# Altium project US29080671(A).PrjPCB (part 7 of 10)

## Sheet Z7_MGTX.SchDoc
size A3
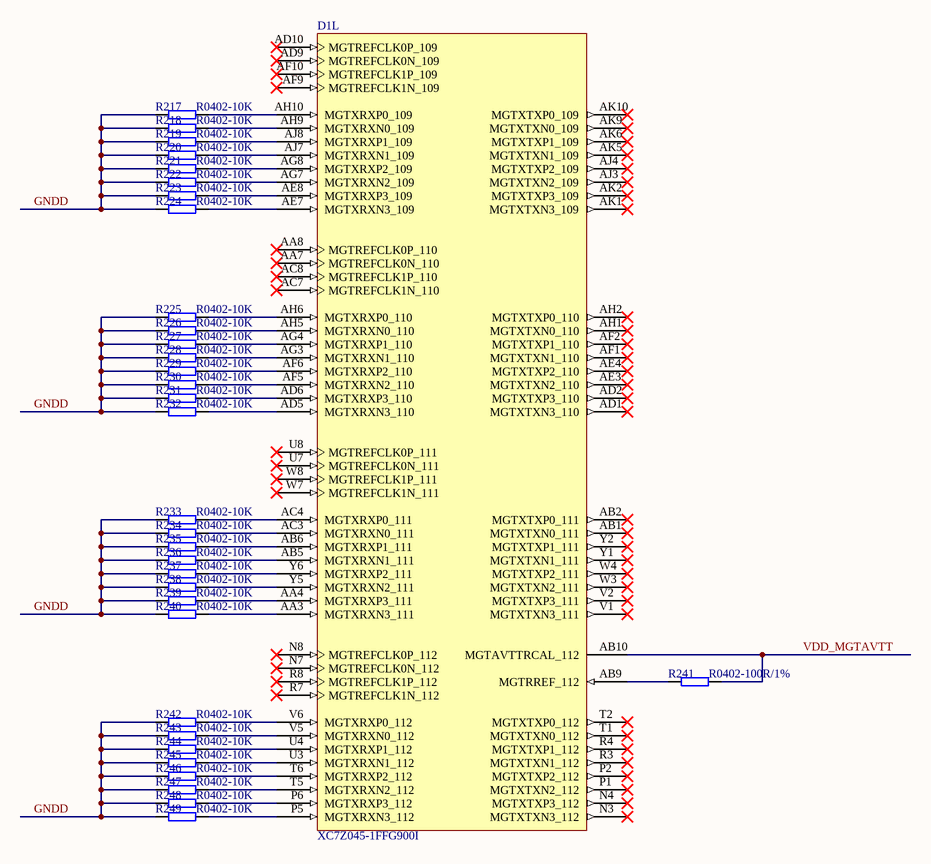
[diagram p32: Z7_MGTX.SchDoc]

### Parts
D1  XC7Z045-1FFG900I  [FFG900]  (part L of 16)
R217  R0402-10K  [R0402]
R218  R0402-10K  [R0402]
R219  R0402-10K  [R0402]
R220  R0402-10K  [R0402]
R221  R0402-10K  [R0402]
R222  R0402-10K  [R0402]
R223  R0402-10K  [R0402]
R224  R0402-10K  [R0402]
R225  R0402-10K  [R0402]
R226  R0402-10K  [R0402]
R227  R0402-10K  [R0402]
R228  R0402-10K  [R0402]
R229  R0402-10K  [R0402]
R230  R0402-10K  [R0402]
R231  R0402-10K  [R0402]
R232  R0402-10K  [R0402]
R233  R0402-10K  [R0402]
R234  R0402-10K  [R0402]
R235  R0402-10K  [R0402]
R236  R0402-10K  [R0402]
R237  R0402-10K  [R0402]
R238  R0402-10K  [R0402]
R239  R0402-10K  [R0402]
R240  R0402-10K  [R0402]
R241  R0402-100R/1%  [R0402]
R242  R0402-10K  [R0402]
R243  R0402-10K  [R0402]
R244  R0402-10K  [R0402]
R245  R0402-10K  [R0402]
R246  R0402-10K  [R0402]
R247  R0402-10K  [R0402]
R248  R0402-10K  [R0402]
R249  R0402-10K  [R0402]

### Nets
GNDD: R217.2 R218.2 R219.2 R220.2 R221.2 R222.2 R223.2 R224.2 R225.2 R226.2 R227.2 R228.2 R229.2 R230.2 R231.2 R232.2 R233.2 R234.2 R235.2 R236.2 R237.2 R238.2 R239.2 R240.2 R242.2 R243.2 R244.2 R245.2 R246.2 R247.2 R248.2 R249.2
VDD_MGTAVTT: D1.AB10(MGTAVTTRCAL_112) R241.1  [project net VCC1V2]
NetD1_AA3: D1.AA3(MGTXRXN3_111) R240.1
NetD1_AA4: D1.AA4(MGTXRXP3_111) R239.1
NetD1_AB5: D1.AB5(MGTXRXN1_111) R236.1
NetD1_AB6: D1.AB6(MGTXRXP1_111) R235.1
NetD1_AB9: D1.AB9(MGTRREF_112) R241.2
NetD1_AC3: D1.AC3(MGTXRXN0_111) R234.1
NetD1_AC4: D1.AC4(MGTXRXP0_111) R233.1
NetD1_AD5: D1.AD5(MGTXRXN3_110) R232.1
NetD1_AD6: D1.AD6(MGTXRXP3_110) R231.1
NetD1_AE7: D1.AE7(MGTXRXN3_109) R224.1
NetD1_AE8: D1.AE8(MGTXRXP3_109) R223.1
NetD1_AF5: D1.AF5(MGTXRXN2_110) R230.1
NetD1_AF6: D1.AF6(MGTXRXP2_110) R229.1
NetD1_AG3: D1.AG3(MGTXRXN1_110) R228.1
NetD1_AG4: D1.AG4(MGTXRXP1_110) R227.1
NetD1_AG7: D1.AG7(MGTXRXN2_109) R222.1
NetD1_AG8: D1.AG8(MGTXRXP2_109) R221.1
NetD1_AH5: D1.AH5(MGTXRXN0_110) R226.1
NetD1_AH6: D1.AH6(MGTXRXP0_110) R225.1
NetD1_AH9: D1.AH9(MGTXRXN0_109) R218.1
NetD1_AH10: D1.AH10(MGTXRXP0_109) R217.1
NetD1_AJ7: D1.AJ7(MGTXRXN1_109) R220.1
NetD1_AJ8: D1.AJ8(MGTXRXP1_109) R219.1
NetD1_P5: D1.P5(MGTXRXN3_112) R249.1
NetD1_P6: D1.P6(MGTXRXP3_112) R248.1
NetD1_T5: D1.T5(MGTXRXN2_112) R247.1
NetD1_T6: D1.T6(MGTXRXP2_112) R246.1
NetD1_U3: D1.U3(MGTXRXN1_112) R245.1
NetD1_U4: D1.U4(MGTXRXP1_112) R244.1
NetD1_V5: D1.V5(MGTXRXN0_112) R243.1
NetD1_V6: D1.V6(MGTXRXP0_112) R242.1
NetD1_Y5: D1.Y5(MGTXRXN2_111) R238.1
NetD1_Y6: D1.Y6(MGTXRXP2_111) R237.1

Not connected (* = marked no-connect by the designer): D1 AA7(MGTREFCLK0N_110)* AA8(MGTREFCLK0P_110)* AB1(MGTXTXN0_111)* AB2(MGTXTXP0_111)* AC7(MGTREFCLK1N_110)* AC8(MGTREFCLK1P_110)* AD1(MGTXTXN3_110)* AD2(MGTXTXP3_110)* AD9(MGTREFCLK0N_109)* AD10(MGTREFCLK0P_109)* AE3(MGTXTXN2_110)* AE4(MGTXTXP2_110)* AF1(MGTXTXN1_110)* AF2(MGTXTXP1_110)* AF9(MGTREFCLK1N_109)* AF10(MGTREFCLK1P_109)* AH1(MGTXTXN0_110)* AH2(MGTXTXP0_110)* AJ3(MGTXTXN2_109)* AJ4(MGTXTXP2_109)* AK1(MGTXTXN3_109)* AK2(MGTXTXP3_109)* AK5(MGTXTXN1_109)* AK6(MGTXTXP1_109)* AK9(MGTXTXN0_109)* AK10(MGTXTXP0_109)* N3(MGTXTXN3_112)* N4(MGTXTXP3_112)* N7(MGTREFCLK0N_112)* N8(MGTREFCLK0P_112)* P1(MGTXTXN2_112)* P2(MGTXTXP2_112)* R3(MGTXTXN1_112)* R4(MGTXTXP1_112)* R7(MGTREFCLK1N_112)* R8(MGTREFCLK1P_112)* T1(MGTXTXN0_112)* T2(MGTXTXP0_112)* U7(MGTREFCLK0N_111)* U8(MGTREFCLK0P_111)* V1(MGTXTXN3_111)* V2(MGTXTXP3_111)* W3(MGTXTXN2_111)* W4(MGTXTXP2_111)* W7(MGTREFCLK1N_111)* W8(MGTREFCLK1P_111)* Y1(MGTXTXN1_111)* Y2(MGTXTXP1_111)*

### Library data of the parts
D1 = XC7Z045-1FFG900I: 667 MHz Zynq?7000 AP SoC, 130 PS I/O, 378 FPGA I/O, 900-Ball BGA, Speed Grade 1, Industrial Grade, Pb-Free; Manufacturer: Xilinx; Extensible Block RAM (# 36Kb Blocks): 2180 KB (545); Flip Flops: 437200; LUTs: 218600; Speed Grade: -1; DatasheetVersion: v1.2; PackageVersion: Rev 1.1; PackageReference: FFG900; PackageDescription: Flip-Chip BGA, Body 31 x 31 mm, 1.0 mm Pitch; Generic Part Number: XC7Z045; RoHS: Pb-Free; Mounting Technology: Surface Mount; Code_JEDEC: MS-034-AAN-1; PartNumber: XC7Z045-1FFG900I; ComponentLink1Description: Datasheet; ComponentLink1URL: http://www.xilinx.com/support/documentation/data_sheets/ds190-Zynq-7000-Overview.pdf; ComponentLink2Description: Package Specification; ComponentLink2URL: http://www.xilinx.com/support/documentation/user_guides/ug865-Zynq-7000-Pkg-Pinout.pdf; ComponentLink3Description: DC and AC Switching Characteristics; ComponentLink3URL: http://www.xilinx.com/support/documentation/data_sheets/ds191-XC7Z030-XC7Z045-data-sheet.pdf; ComponentLink4Description: Package File; ComponentLink4URL: http://www.xilinx.com/support/packagefiles/z7packages/xc7z045ffg900pkg.txt; ComponentLink5Description: Packaging and Pinout; ComponentLink5URL: http://www.xilinx.com/support/documentation/user_guides/ug865-Zynq-7000-Pkg-Pinout.pdf; ComponentLink6Description: PCB and Layout Guide; ComponentLink6URL: http://www.xilinx.com/support/documentation/user_guides/ug483_7Series_PCB.pdf
R217-R249 = R0402-10K: Manufacturer: SAMSUNG; Part_type: RES; Schematic_Part: RES; PCB_Footprint: R0402
  R217-R240 R242-R249: Part_number: R0402-10K; Value: R0402-10K
  R241: Part_number: R0402-100R/1%; Value: R0402-100R/1%

## Sheet Z7_FUNCTION1.SchDoc
size A3
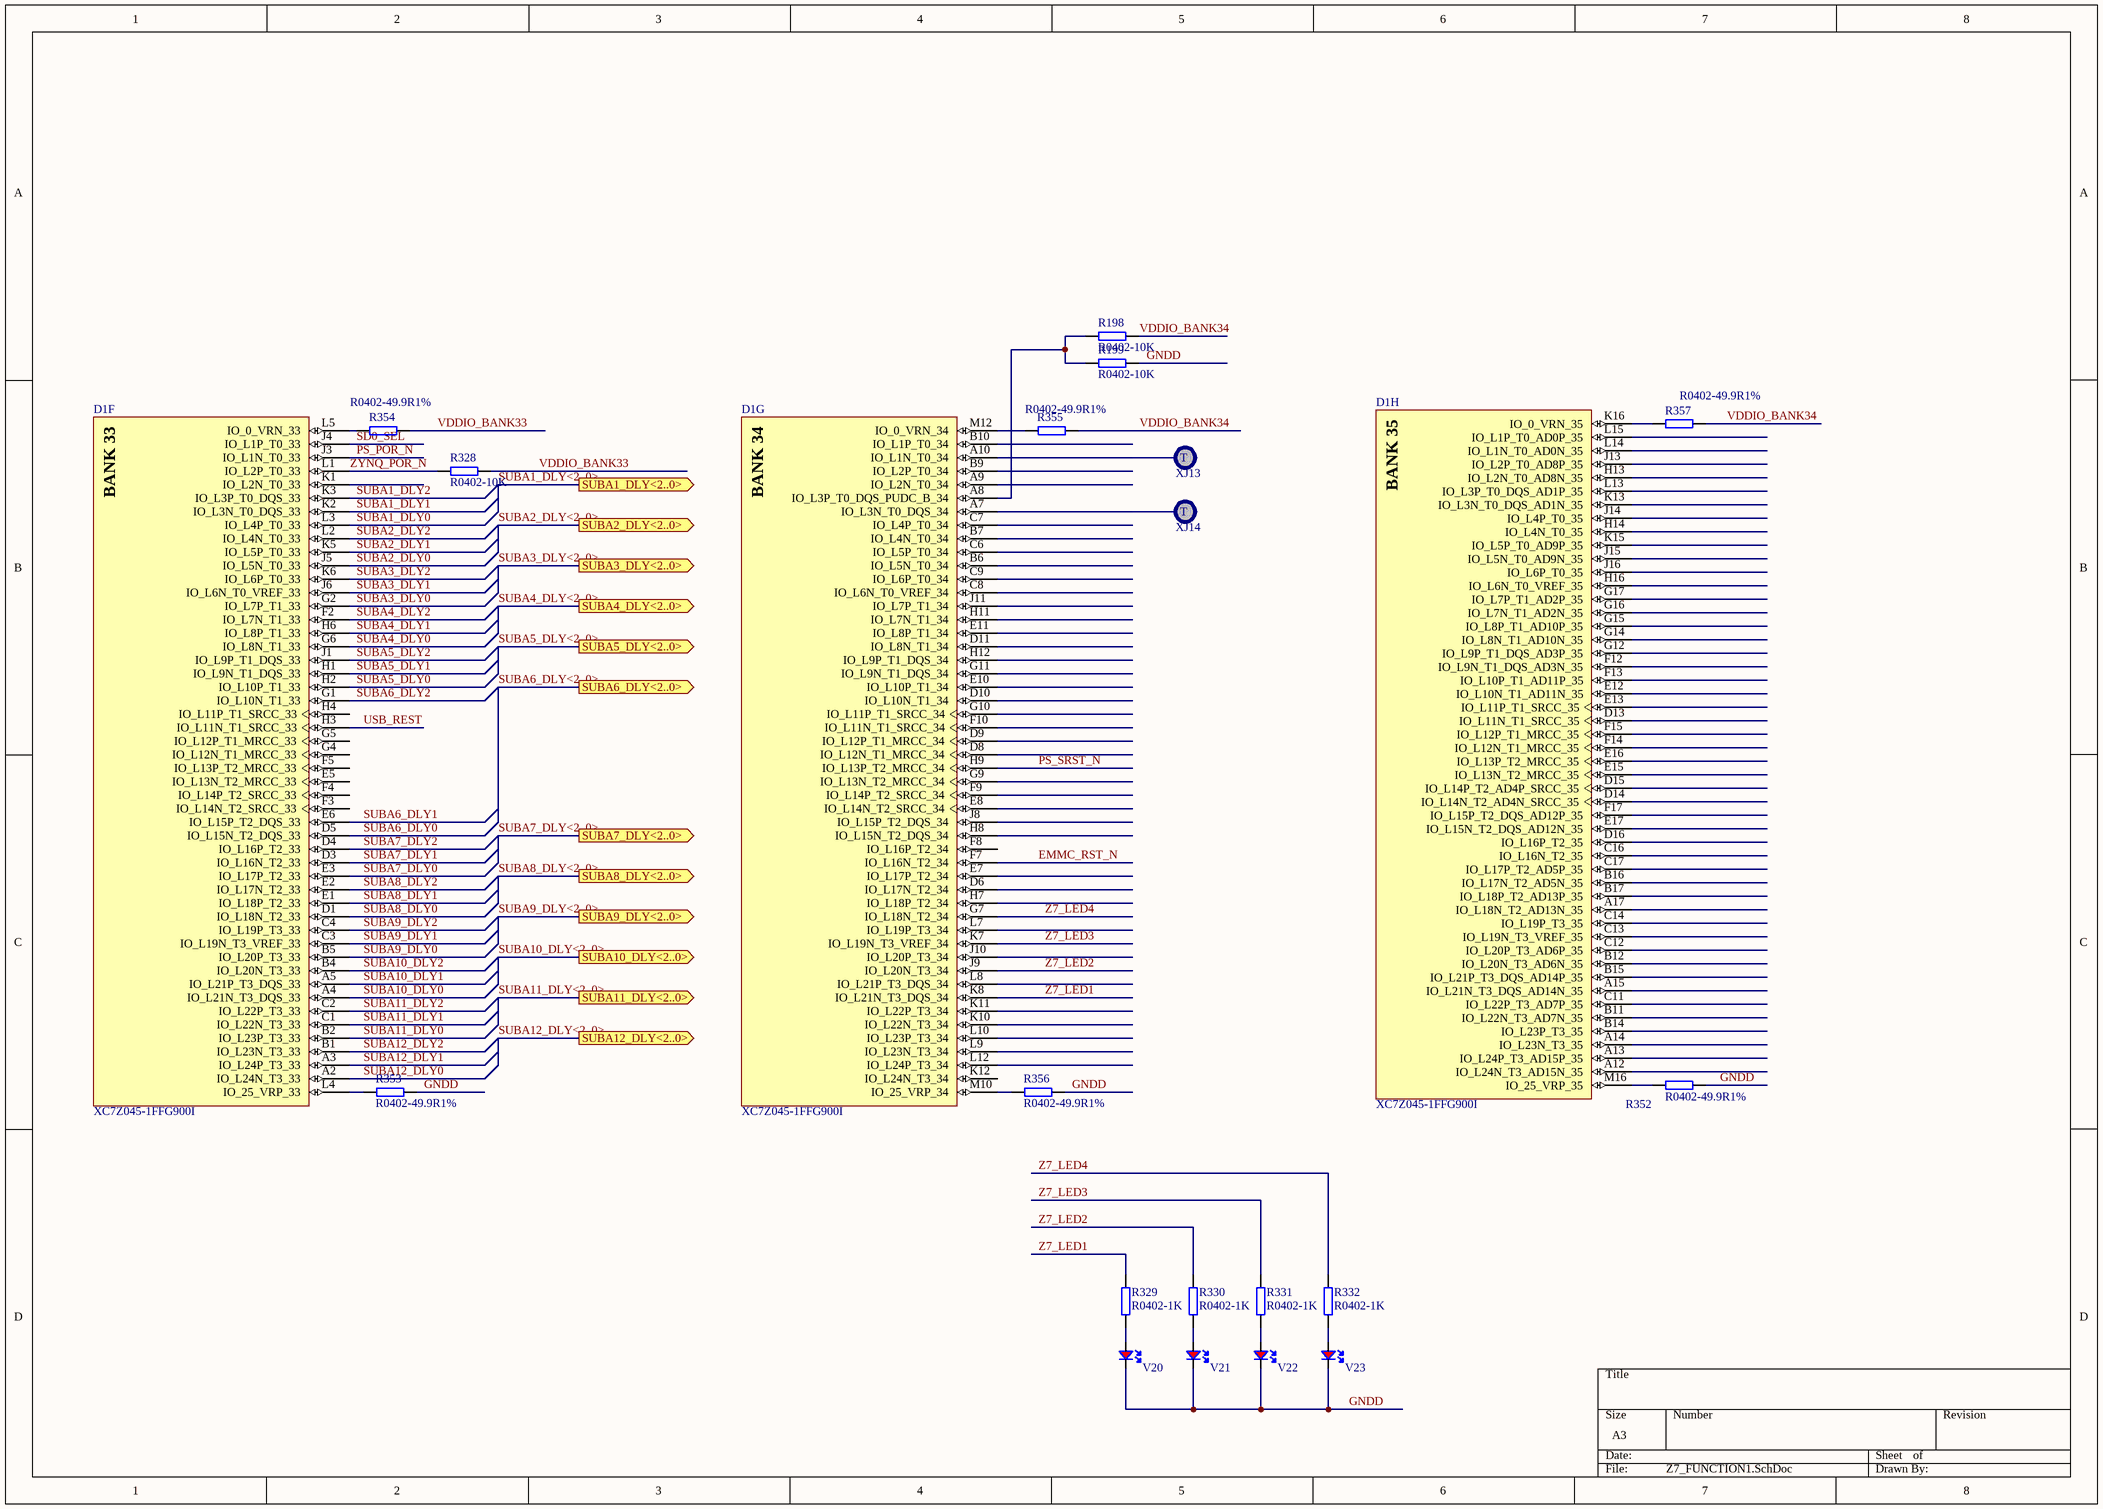
[diagram p33: Z7_FUNCTION1.SchDoc]

### Parts
D1  XC7Z045-1FFG900I  [FFG900]  (parts F,G,H of 16)
R198  R0402-10K  [R0402]
R199  R0402-10K  [R0402]
R328  R0402-10K  [R0402]
R329  R0402-1K  [R0402]
R330  R0402-1K  [R0402]
R331  R0402-1K  [R0402]
R332  R0402-1K  [R0402]
R352  R0402-49.9R1%  [R0402]
R353  R0402-49.9R1%  [R0402]
R354  R0402-49.9R1%  [R0402]
R355  R0402-49.9R1%  [R0402]
R356  R0402-49.9R1%  [R0402]
R357  R0402-49.9R1%  [R0402]
V20  LED-R0603  [LED-R0603]  (value not drawn)
V21  LED-R0603  [LED-R0603]  (value not drawn)
V22  LED-R0603  [LED-R0603]  (value not drawn)
V23  LED-R0603  [LED-R0603]  (value not drawn)
XJ13  TESTPOINT  [TEST-pin]  (value not drawn)
XJ14  TESTPOINT  [TEST-pin]  (value not drawn)

### Ports
SUBA1_DLY<2..0> (out), SUBA2_DLY<2..0> (out), SUBA3_DLY<2..0> (out), SUBA4_DLY<2..0> (out), SUBA5_DLY<2..0> (out), SUBA6_DLY<2..0> (out), SUBA7_DLY<2..0> (out), SUBA8_DLY<2..0> (out), SUBA9_DLY<2..0> (out), SUBA10_DLY<2..0> (out), SUBA11_DLY<2..0> (out), SUBA12_DLY<2..0> (out)

### Nets
GNDD: R199.2 R352.2 R353.2 R356.2 V20.2(K) V21.2(K) V22.2(K) V23.2(K)
VDDIO_BANK33: R198.2 R328.1 R354.2 R355.2 R357.2  [also labelled VDDIO_BANK34]  [project net VCC1V8]
EMMC_RST_N: D1.F7(IO_L16N_T2_34)
PS_POR_N: D1.J3(IO_L1N_T0_33)
PS_SRST_N: D1.H9(IO_L13P_T2_MRCC_34)
SD0_SEL: D1.J4(IO_L1P_T0_33)
SUBA1_DLY0: D1.L3(IO_L4P_T0_33)
SUBA1_DLY1: D1.K2(IO_L3N_T0_DQS_33)
SUBA1_DLY2: D1.K3(IO_L3P_T0_DQS_33)
SUBA2_DLY0: D1.J5(IO_L5N_T0_33)
SUBA2_DLY1: D1.K5(IO_L5P_T0_33)
SUBA2_DLY2: D1.L2(IO_L4N_T0_33)
SUBA3_DLY0: D1.G2(IO_L7P_T1_33)
SUBA3_DLY1: D1.J6(IO_L6N_T0_VREF_33)
SUBA3_DLY2: D1.K6(IO_L6P_T0_33)
SUBA4_DLY0: D1.G6(IO_L8N_T1_33)
SUBA4_DLY1: D1.H6(IO_L8P_T1_33)
SUBA4_DLY2: D1.F2(IO_L7N_T1_33)
SUBA5_DLY0: D1.H2(IO_L10P_T1_33)
SUBA5_DLY1: D1.H1(IO_L9N_T1_DQS_33)
SUBA5_DLY2: D1.J1(IO_L9P_T1_DQS_33)
SUBA6_DLY0: D1.D5(IO_L15N_T2_DQS_33)
SUBA6_DLY1: D1.E6(IO_L15P_T2_DQS_33)
SUBA6_DLY2: D1.G1(IO_L10N_T1_33)
SUBA7_DLY0: D1.E3(IO_L17P_T2_33)
SUBA7_DLY1: D1.D3(IO_L16N_T2_33)
SUBA7_DLY2: D1.D4(IO_L16P_T2_33)
SUBA8_DLY0: D1.D1(IO_L18N_T2_33)
SUBA8_DLY1: D1.E1(IO_L18P_T2_33)
SUBA8_DLY2: D1.E2(IO_L17N_T2_33)
SUBA9_DLY0: D1.B5(IO_L20P_T3_33)
SUBA9_DLY1: D1.C3(IO_L19N_T3_VREF_33)
SUBA9_DLY2: D1.C4(IO_L19P_T3_33)
SUBA10_DLY0: D1.A4(IO_L21N_T3_DQS_33)
SUBA10_DLY1: D1.A5(IO_L21P_T3_DQS_33)
SUBA10_DLY2: D1.B4(IO_L20N_T3_33)
SUBA11_DLY0: D1.B2(IO_L23P_T3_33)
SUBA11_DLY1: D1.C1(IO_L22N_T3_33)
SUBA11_DLY2: D1.C2(IO_L22P_T3_33)
SUBA12_DLY0: D1.A2(IO_L24N_T3_33)
SUBA12_DLY1: D1.A3(IO_L24P_T3_33)
SUBA12_DLY2: D1.B1(IO_L23N_T3_33)
USB_REST: D1.H3(IO_L11N_T1_SRCC_33)
Z7_LED1: D1.K8(IO_L21N_T3_DQS_34) R329.2
Z7_LED2: D1.J9(IO_L20N_T3_34) R330.2
Z7_LED3: D1.K7(IO_L19N_T3_VREF_34) R331.2
Z7_LED4: D1.G7(IO_L18N_T2_34) R332.2
ZYNQ_POR_N: D1.L1(IO_L2P_T0_33) R328.2
NetD1_A7: D1.A7(IO_L3N_T0_DQS_34) XJ14.1(T)
NetD1_A8: D1.A8(IO_L3P_T0_DQS_PUDC_B_34) R198.1 R199.1
NetD1_A10: D1.A10(IO_L1N_T0_34) XJ13.1(T)
NetD1_K16: D1.K16(IO_0_VRN_35) R357.1
NetD1_L4: D1.L4(IO_25_VRP_33) R353.1
NetD1_L5: D1.L5(IO_0_VRN_33) R354.1
NetD1_M10: D1.M10(IO_25_VRP_34) R356.1
NetD1_M12: D1.M12(IO_0_VRN_34) R355.1
NetD1_M16: D1.M16(IO_25_VRP_35) R352.1
NetR329_1: R329.1 V20.1(A)
NetR330_1: R330.1 V21.1(A)
NetR331_1: R331.1 V22.1(A)
NetR332_1: R332.1 V23.1(A)

Not connected (* = marked no-connect by the designer): D1 A9(IO_L2N_T0_34) A12(IO_L24N_T3_AD15N_35) A13(IO_L24P_T3_AD15P_35) A14(IO_L23N_T3_35) A15(IO_L21N_T3_DQS_AD14N_35) A17(IO_L18N_T2_AD13N_35) B6(IO_L5N_T0_34) B7(IO_L4N_T0_34) B9(IO_L2P_T0_34) B10(IO_L1P_T0_34) B11(IO_L22N_T3_AD7N_35) B12(IO_L20N_T3_AD6N_35) B14(IO_L23P_T3_35) B15(IO_L21P_T3_DQS_AD14P_35) B16(IO_L17N_T2_AD5N_35) B17(IO_L18P_T2_AD13P_35) C6(IO_L5P_T0_34) C7(IO_L4P_T0_34) C8(IO_L6N_T0_VREF_34) C9(IO_L6P_T0_34) C11(IO_L22P_T3_AD7P_35) C12(IO_L20P_T3_AD6P_35) C13(IO_L19N_T3_VREF_35) C14(IO_L19P_T3_35) C16(IO_L16N_T2_35) C17(IO_L17P_T2_AD5P_35) D6(IO_L17N_T2_34) D8(IO_L12N_T1_MRCC_34) D9(IO_L12P_T1_MRCC_34) D10(IO_L10N_T1_34) D11(IO_L8N_T1_34) D13(IO_L11N_T1_SRCC_35) D14(IO_L14N_T2_AD4N_SRCC_35) D15(IO_L14P_T2_AD4P_SRCC_35) D16(IO_L16P_T2_35) E5(IO_L13N_T2_MRCC_33) E7(IO_L17P_T2_34) E8(IO_L14N_T2_SRCC_34) E10(IO_L10P_T1_34) E11(IO_L8P_T1_34) E12(IO_L10N_T1_AD11N_35) E13(IO_L11P_T1_SRCC_35) E15(IO_L13N_T2_MRCC_35) E16(IO_L13P_T2_MRCC_35) E17(IO_L15N_T2_DQS_AD12N_35) F3(IO_L14N_T2_SRCC_33) F4(IO_L14P_T2_SRCC_33) F5(IO_L13P_T2_MRCC_33) F8(IO_L16P_T2_34) F9(IO_L14P_T2_SRCC_34) F10(IO_L11N_T1_SRCC_34) F12(IO_L9N_T1_DQS_AD3N_35) F13(IO_L10P_T1_AD11P_35) F14(IO_L12N_T1_MRCC_35) F15(IO_L12P_T1_MRCC_35) F17(IO_L15P_T2_DQS_AD12P_35) G4(IO_L12N_T1_MRCC_33) G5(IO_L12P_T1_MRCC_33) G9(IO_L13N_T2_MRCC_34) G10(IO_L11P_T1_SRCC_34) G11(IO_L9N_T1_DQS_34) G12(IO_L9P_T1_DQS_AD3P_35) G14(IO_L8N_T1_AD10N_35) G15(IO_L8P_T1_AD10P_35) G16(IO_L7N_T1_AD2N_35) G17(IO_L7P_T1_AD2P_35) H4(IO_L11P_T1_SRCC_33) H7(IO_L18P_T2_34) H8(IO_L15N_T2_DQS_34) H11(IO_L7N_T1_34) H12(IO_L9P_T1_DQS_34) H13(IO_L2N_T0_AD8N_35) H14(IO_L4N_T0_35) H16(IO_L6N_T0_VREF_35) J8(IO_L15P_T2_DQS_34) J10(IO_L20P_T3_34) J11(IO_L7P_T1_34) J13(IO_L2P_T0_AD8P_35) J14(IO_L4P_T0_35) J15(IO_L5N_T0_AD9N_35) J16(IO_L6P_T0_35) K1(IO_L2N_T0_33) K10(IO_L22N_T3_34) K11(IO_L22P_T3_34) K12(IO_L24N_T3_34) K13(IO_L3N_T0_DQS_AD1N_35) K15(IO_L5P_T0_AD9P_35) L7(IO_L19P_T3_34) L8(IO_L21P_T3_DQS_34) L9(IO_L23N_T3_34) L10(IO_L23P_T3_34) L12(IO_L24P_T3_34) L13(IO_L3P_T0_DQS_AD1P_35) L14(IO_L1N_T0_AD0N_35) L15(IO_L1P_T0_AD0P_35)

### Buses and harness runs
bus SUBA1_DLY<2..0> = port SUBA1_DLY<2..0>
bus SUBA2_DLY<2..0> = port SUBA2_DLY<2..0>
bus SUBA3_DLY<2..0> = port SUBA3_DLY<2..0>
bus SUBA4_DLY<2..0> = port SUBA4_DLY<2..0>
bus SUBA5_DLY<2..0> = port SUBA5_DLY<2..0>
bus SUBA6_DLY<2..0> = port SUBA6_DLY<2..0>
bus SUBA7_DLY<2..0> = port SUBA7_DLY<2..0>
bus SUBA8_DLY<2..0> = port SUBA8_DLY<2..0>
bus SUBA9_DLY<2..0> = port SUBA9_DLY<2..0>
bus SUBA10_DLY<2..0> = port SUBA10_DLY<2..0>
bus SUBA11_DLY<2..0> = port SUBA11_DLY<2..0>
bus SUBA12_DLY<2..0> = port SUBA12_DLY<2..0>

### Notes on the sheet
- (in symbol XC7Z045-1FFG900I, part F) BANK 33
- (in symbol XC7Z045-1FFG900I, part G) BANK 34
- (in symbol XC7Z045-1FFG900I, part H) BANK 35

### Library data of the parts
D1 = XC7Z045-1FFG900I: as D1 on sheet Z7_MGTX; DatasheetVersion: v1.2; PackageVersion: Rev 1.1; PackageReference: FFG900; PackageDescription: Flip-Chip BGA, Body 31 x 31 mm, 1.0 mm Pitch; Generic Part Number: XC7Z045; RoHS: Pb-Free; Mounting Technology: Surface Mount; Code_JEDEC: MS-034-AAN-1; PartNumber: XC7Z045-1FFG900I; ComponentLink1Description: Datasheet; ComponentLink1URL: http://www.xilinx.com/support/documentation/data_sheets/ds190-Zynq-7000-Overview.pdf; ComponentLink2Description: Package Specification; ComponentLink2URL: http://www.xilinx.com/support/documentation/user_guides/ug865-Zynq-7000-Pkg-Pinout.pdf; ComponentLink3Description: DC and AC Switching Characteristics; ComponentLink3URL: http://www.xilinx.com/support/documentation/data_sheets/ds191-XC7Z030-XC7Z045-data-sheet.pdf; ComponentLink4Description: Package File; ComponentLink4URL: http://www.xilinx.com/support/packagefiles/z7packages/xc7z045ffg900pkg.txt; ComponentLink5Description: Packaging and Pinout; ComponentLink5URL: http://www.xilinx.com/support/documentation/user_guides/ug865-Zynq-7000-Pkg-Pinout.pdf; ComponentLink6Description: PCB and Layout Guide; ComponentLink6URL: http://www.xilinx.com/support/documentation/user_guides/ug483_7Series_PCB.pdf
R198 R199 R328-R332 R352-R357 = R0402-10K: Manufacturer: SAMSUNG; Part_type: RES; Schematic_Part: RES; PCB_Footprint: R0402
  R198 R199 R328: Part_number: R0402-10K; Value: R0402-10K
  R329-R332: Part_number: R0402-1K; Value: R0402-1K
  R352-R357: Part_number: R0402-49.9R1%; Value: R0402-49.9R1%
V20-V23 = LED-R0603: 表贴发光二极管, 0603封装, 体积1.6x0.8mm, 红色, 高度0.8mm; Part_type: DIODES; Part_number: LED-R0603; Value: LED-R0603; Schematic_Part: LED-R; PCB_Footprint: LED-R0603
XJ13 XJ14 = TESTPOINT: 测试点; Part_type: Miscellaneous; Part_number: TESTPOINT; Value: TESTPOINT; Schematic_Part: TESTPOINT; PCB_Footprint: TEST-pin

## Sheet Z7_FUNCTION2.SchDoc
size A3
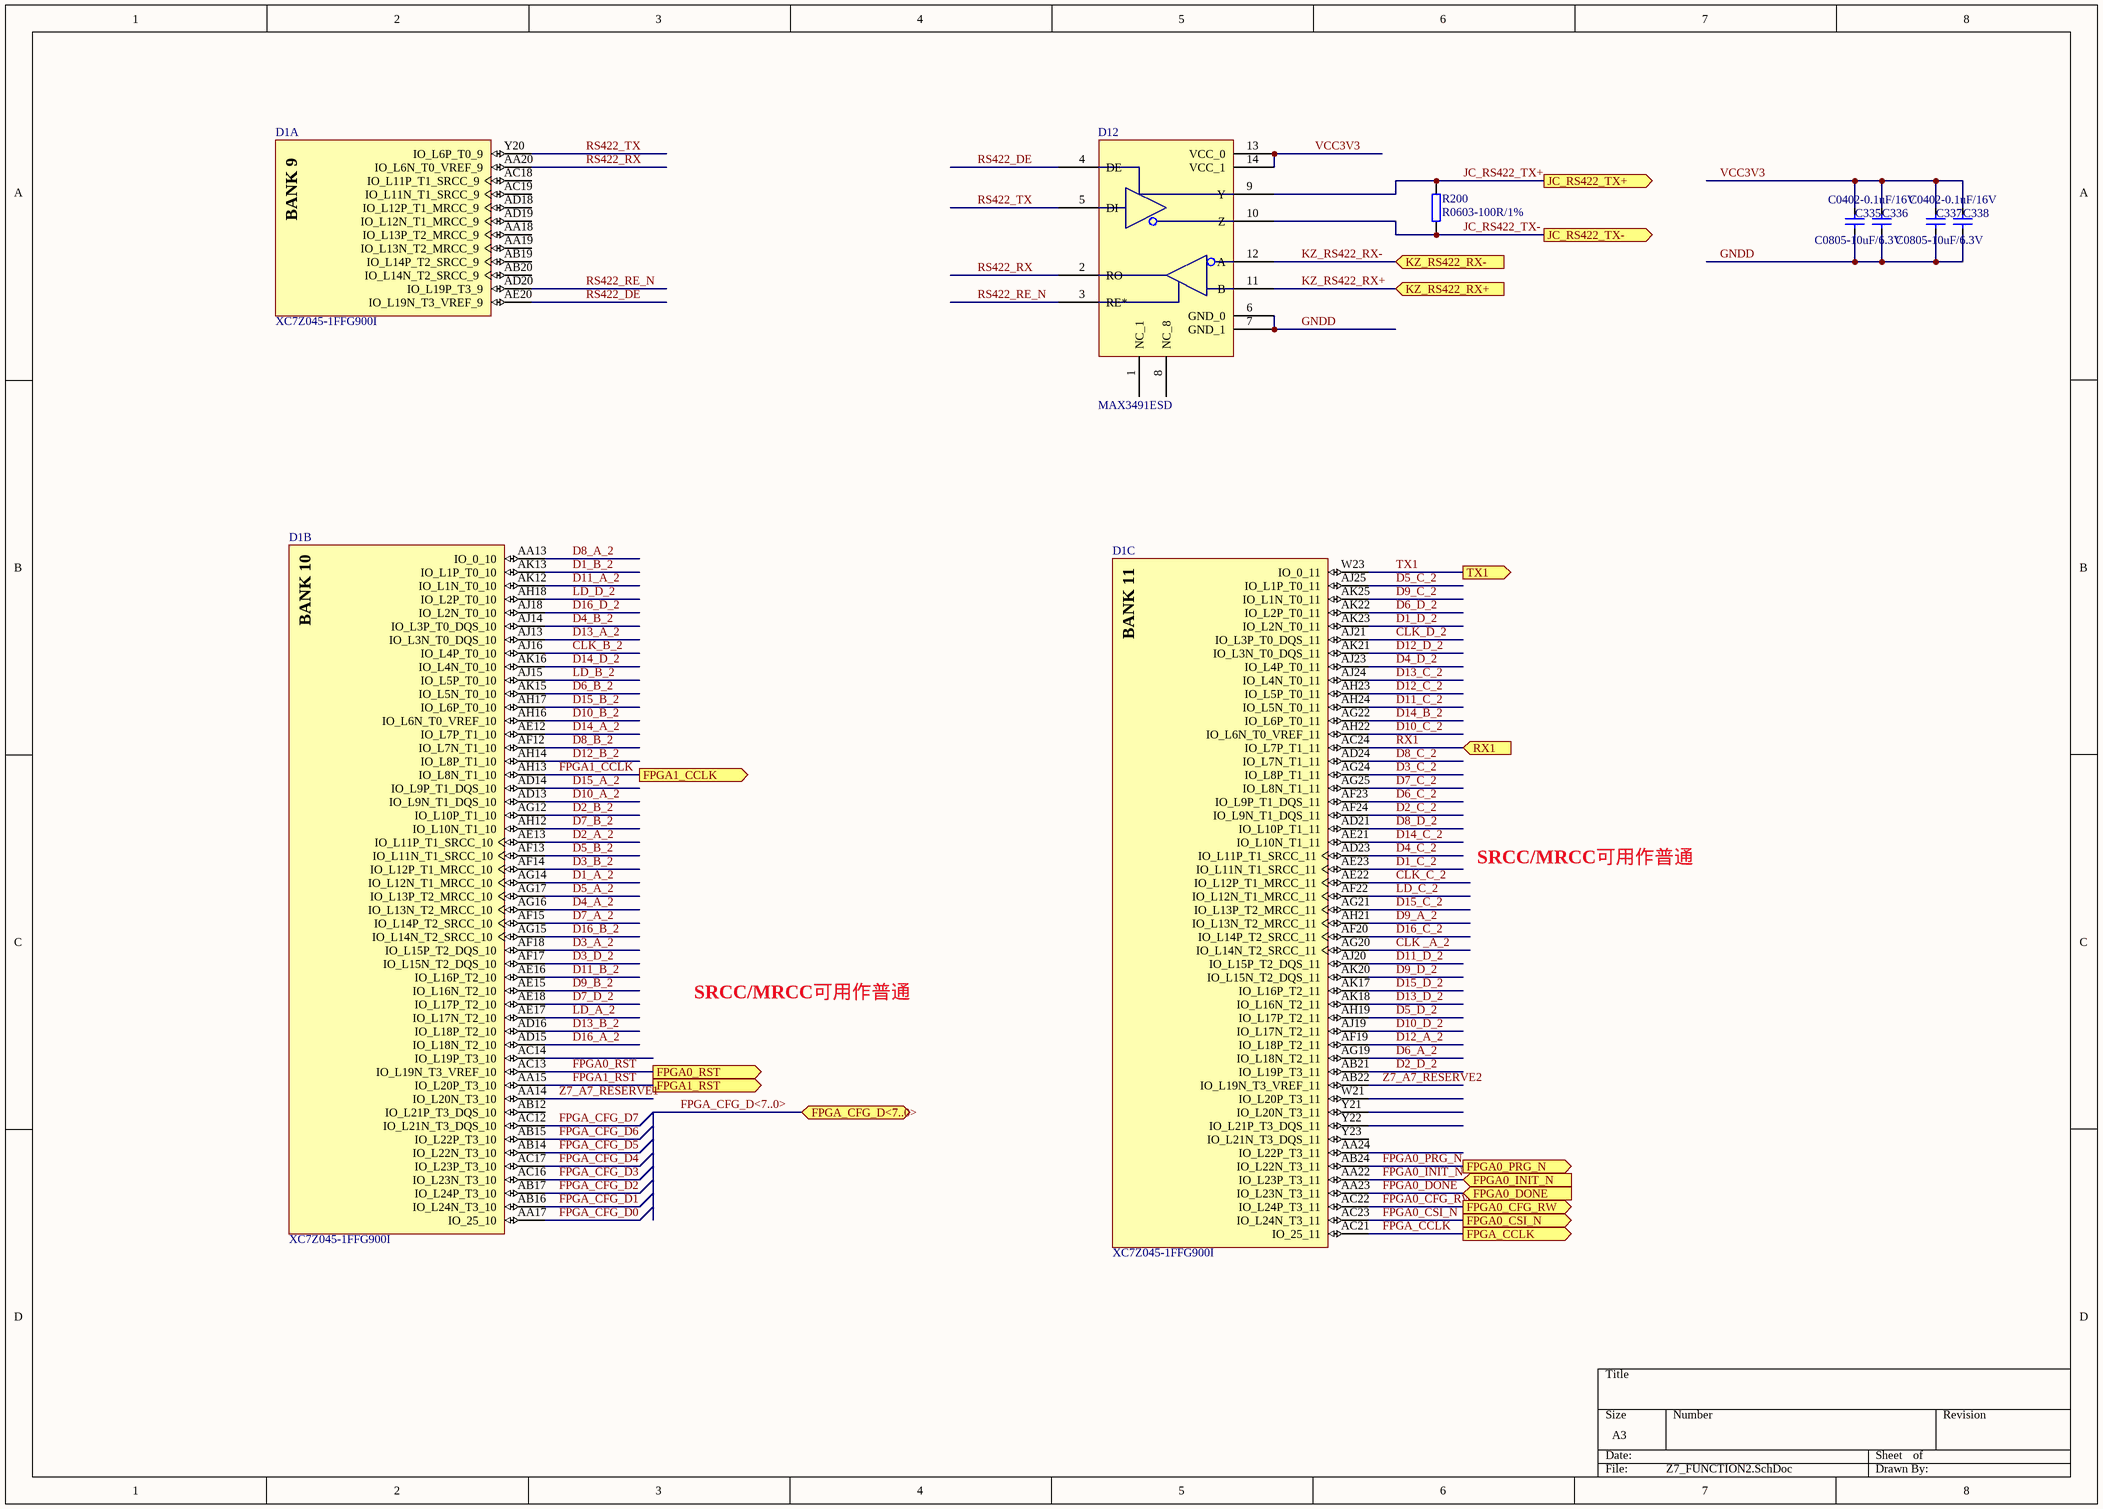
[diagram p34: Z7_FUNCTION2.SchDoc]

### Parts
C335  C0805-10uF/6.3V  [C0805]
C336  C0402-0.1uF/16V  [C0402]
C337  C0805-10uF/6.3V  [C0805]
C338  C0402-0.1uF/16V  [C0402]
D1  XC7Z045-1FFG900I  [FFG900]  (parts A,B,C of 16)
D12  MAX3491ESD  [SO-14]
R200  R0603-100R/1%  [R0603]

### Ports
FPGA0_CFG_RW (out), FPGA0_CSI_N (out), FPGA0_DONE (in), FPGA0_INIT_N (in), FPGA0_PRG_N (out), FPGA0_RST (out), FPGA1_CCLK (out), FPGA1_RST (out), FPGA_CCLK (out), FPGA_CFG_D<7..0> (bidir), JC_RS422_TX+ (out), JC_RS422_TX- (out), KZ_RS422_RX+ (in), KZ_RS422_RX- (in), RX1 (in), TX1 (out)

### Nets
GNDD: C335.2 C336.2 C337.2 C338.2 D12.6(GND_0) D12.7(GND_1)
VCC3V3: C335.1 C336.1 C337.1 C338.1 D12.13(VCC_0) D12.14(VCC_1)
CLK _A_2: D1.AG20(IO_L14N_T2_SRCC_11)
CLK_B_2: D1.AJ16(IO_L4P_T0_10)
CLK_C_2: D1.AE22(IO_L12P_T1_MRCC_11)
CLK_D_2: D1.AJ21(IO_L3P_T0_DQS_11)
D1_A_2: D1.AG14(IO_L12N_T1_MRCC_10)
D1_B_2: D1.AK13(IO_L1P_T0_10)
D1_C_2: D1.AE23(IO_L11N_T1_SRCC_11)
D1_D_2: D1.AK23(IO_L2N_T0_11)
D2_A_2: D1.AE13(IO_L11P_T1_SRCC_10)
D2_B_2: D1.AG12(IO_L10P_T1_10)
D2_C_2: D1.AF24(IO_L9N_T1_DQS_11)
D2_D_2: D1.AB21(IO_L19P_T3_11)
D3_A_2: D1.AF18(IO_L15P_T2_DQS_10)
D3_B_2: D1.AF14(IO_L12P_T1_MRCC_10)
D3_C_2: D1.AG24(IO_L8P_T1_11)
D3_D_2: D1.AF17(IO_L15N_T2_DQS_10)
D4_A_2: D1.AG16(IO_L13N_T2_MRCC_10)
D4_B_2: D1.AJ14(IO_L3P_T0_DQS_10)
D4_C_2: D1.AD23(IO_L11P_T1_SRCC_11)
D4_D_2: D1.AJ23(IO_L4P_T0_11)
D5_A_2: D1.AG17(IO_L13P_T2_MRCC_10)
D5_B_2: D1.AF13(IO_L11N_T1_SRCC_10)
D5_C_2: D1.AJ25(IO_L1P_T0_11)
D5_D_2: D1.AH19(IO_L17P_T2_11)
D6_A_2: D1.AG19(IO_L18N_T2_11)
D6_B_2: D1.AK15(IO_L5N_T0_10)
D6_C_2: D1.AF23(IO_L9P_T1_DQS_11)
D6_D_2: D1.AK22(IO_L2P_T0_11)
D7_A_2: D1.AF15(IO_L14P_T2_SRCC_10)
D7_B_2: D1.AH12(IO_L10N_T1_10)
D7_C_2: D1.AG25(IO_L8N_T1_11)
D7_D_2: D1.AE18(IO_L17P_T2_10)
D8_A_2: D1.AA13(IO_0_10)
D8_B_2: D1.AF12(IO_L7N_T1_10)
D8_C_2: D1.AD24(IO_L7N_T1_11)
D8_D_2: D1.AD21(IO_L10P_T1_11)
D9_A_2: D1.AH21(IO_L13N_T2_MRCC_11)
D9_B_2: D1.AE15(IO_L16N_T2_10)
D9_C_2: D1.AK25(IO_L1N_T0_11)
D9_D_2: D1.AK20(IO_L15N_T2_DQS_11)
D10_A_2: D1.AD13(IO_L9N_T1_DQS_10)
D10_B_2: D1.AH16(IO_L6N_T0_VREF_10)
D10_C_2: D1.AH22(IO_L6N_T0_VREF_11)
D10_D_2: D1.AJ19(IO_L17N_T2_11)
D11_A_2: D1.AK12(IO_L1N_T0_10)
D11_B_2: D1.AE16(IO_L16P_T2_10)
D11_C_2: D1.AH24(IO_L5N_T0_11)
D11_D_2: D1.AJ20(IO_L15P_T2_DQS_11)
D12_A_2: D1.AF19(IO_L18P_T2_11)
D12_B_2: D1.AH14(IO_L8P_T1_10)
D12_C_2: D1.AH23(IO_L5P_T0_11)
D12_D_2: D1.AK21(IO_L3N_T0_DQS_11)
D13_A_2: D1.AJ13(IO_L3N_T0_DQS_10)
D13_B_2: D1.AD16(IO_L18P_T2_10)
D13_C_2: D1.AJ24(IO_L4N_T0_11)
D13_D_2: D1.AK18(IO_L16N_T2_11)
D14_A_2: D1.AE12(IO_L7P_T1_10)
D14_B_2: D1.AG22(IO_L6P_T0_11)
D14_C_2: D1.AE21(IO_L10N_T1_11)
D14_D_2: D1.AK16(IO_L4N_T0_10)
D15_A_2: D1.AD14(IO_L9P_T1_DQS_10)
D15_B_2: D1.AH17(IO_L6P_T0_10)
D15_C_2: D1.AG21(IO_L13P_T2_MRCC_11)
D15_D_2: D1.AK17(IO_L16P_T2_11)
D16_A_2: D1.AD15(IO_L18N_T2_10)
D16_B_2: D1.AG15(IO_L14N_T2_SRCC_10)
D16_C_2: D1.AF20(IO_L14P_T2_SRCC_11)
D16_D_2: D1.AJ18(IO_L2N_T0_10)
FPGA0_CFG_RW: D1.AC22(IO_L24P_T3_11) ; port FPGA0_CFG_RW
FPGA0_CSI_N: D1.AC23(IO_L24N_T3_11) ; port FPGA0_CSI_N
FPGA0_DONE: D1.AA23(IO_L23N_T3_11) ; port FPGA0_DONE
FPGA0_INIT_N: D1.AA22(IO_L23P_T3_11) ; port FPGA0_INIT_N
FPGA0_PRG_N: D1.AB24(IO_L22N_T3_11) ; port FPGA0_PRG_N
FPGA0_RST: D1.AC13(IO_L19N_T3_VREF_10) ; port FPGA0_RST
FPGA1_CCLK: D1.AH13(IO_L8N_T1_10) ; port FPGA1_CCLK
FPGA1_RST: D1.AA15(IO_L20P_T3_10) ; port FPGA1_RST
FPGA_CCLK: D1.AC21(IO_25_11) ; port FPGA_CCLK
FPGA_CFG_D0: D1.AA17(IO_25_10)
FPGA_CFG_D1: D1.AB16(IO_L24N_T3_10)
FPGA_CFG_D2: D1.AB17(IO_L24P_T3_10)
FPGA_CFG_D3: D1.AC16(IO_L23N_T3_10)
FPGA_CFG_D4: D1.AC17(IO_L23P_T3_10)
FPGA_CFG_D5: D1.AB14(IO_L22N_T3_10)
FPGA_CFG_D6: D1.AB15(IO_L22P_T3_10)
FPGA_CFG_D7: D1.AC12(IO_L21N_T3_DQS_10)
JC_RS422_TX+: D12.9(Y) R200.2 ; port JC_RS422_TX+
JC_RS422_TX-: D12.10(Z) R200.1 ; port JC_RS422_TX-
KZ_RS422_RX+: D12.11(B) ; port KZ_RS422_RX+
KZ_RS422_RX-: D12.12(A) ; port KZ_RS422_RX-
LD_A_2: D1.AE17(IO_L17N_T2_10)
LD_B_2: D1.AJ15(IO_L5P_T0_10)
LD_C_2: D1.AF22(IO_L12N_T1_MRCC_11)
LD_D_2: D1.AH18(IO_L2P_T0_10)
RS422_DE: D1.AE20(IO_L19N_T3_VREF_9) D12.4(DE)
RS422_RE_N: D1.AD20(IO_L19P_T3_9) D12.3(RE*)
RS422_RX: D1.AA20(IO_L6N_T0_VREF_9) D12.2(RO)
RS422_TX: D1.Y20(IO_L6P_T0_9) D12.5(DI)
RX1: D1.AC24(IO_L7P_T1_11) ; port RX1
TX1: D1.W23(IO_0_11) ; port TX1
Z7_A7_RESERVE1: D1.AA14(IO_L20N_T3_10)
Z7_A7_RESERVE2: D1.AB22(IO_L19N_T3_VREF_11)

Not connected (* = marked no-connect by the designer): D1 AA18(IO_L13P_T2_MRCC_9) AA19(IO_L13N_T2_MRCC_9) AA24(IO_L22P_T3_11) AB12(IO_L21P_T3_DQS_10) AB19(IO_L14P_T2_SRCC_9) AB20(IO_L14N_T2_SRCC_9) AC14(IO_L19P_T3_10) AC18(IO_L11P_T1_SRCC_9) AC19(IO_L11N_T1_SRCC_9) AD18(IO_L12P_T1_MRCC_9) AD19(IO_L12N_T1_MRCC_9) W21(IO_L20P_T3_11) Y21(IO_L20N_T3_11) Y22(IO_L21P_T3_DQS_11) Y23(IO_L21N_T3_DQS_11); D12 1(NC_1) 8(NC_8)

### Buses and harness runs
bus FPGA_CFG_D<7..0> = port FPGA_CFG_D<7..0>

### Notes on the sheet
- SRCC/MRCC可用作普通
- (in symbol XC7Z045-1FFG900I, part A) BANK 9
- (in symbol XC7Z045-1FFG900I, part B) BANK 10
- (in symbol XC7Z045-1FFG900I, part C) BANK 11

### Library data of the parts
C335 C337 = C1210-22uF/16V: Part_number: C0805-10uF/6.3V; Part_type: CAP; Value: C0805-10uF/6.3V; Schematic_Part: CAP; PCB_Footprint: C0805
C336 C338 = C0402-0.1uF/16V: X7R; Manufacturer: SAMSUNG; Manufacturer_p/n: CL05X7R104KO5NNN; Part_number: C0402-0.1uF/16V; Part_type: CAP; Value: C0402-0.1uF/16V; temperature: -55℃\+125℃; Schematic_Part: CAP; PCB_Footprint: C0402; datasheet: #DataSheet\C_Samsung_General Capacitors.pdf#
D1 = XC7Z045-1FFG900I: as D1 on sheet Z7_MGTX; DatasheetVersion: v1.2; PackageVersion: Rev 1.1; PackageReference: FFG900; PackageDescription: Flip-Chip BGA, Body 31 x 31 mm, 1.0 mm Pitch; Generic Part Number: XC7Z045; RoHS: Pb-Free; Mounting Technology: Surface Mount; Code_JEDEC: MS-034-AAN-1; PartNumber: XC7Z045-1FFG900I; ComponentLink1Description: Datasheet; ComponentLink1URL: http://www.xilinx.com/support/documentation/data_sheets/ds190-Zynq-7000-Overview.pdf; ComponentLink2Description: Package Specification; ComponentLink2URL: http://www.xilinx.com/support/documentation/user_guides/ug865-Zynq-7000-Pkg-Pinout.pdf; ComponentLink3Description: DC and AC Switching Characteristics; ComponentLink3URL: http://www.xilinx.com/support/documentation/data_sheets/ds191-XC7Z030-XC7Z045-data-sheet.pdf; ComponentLink4Description: Package File; ComponentLink4URL: http://www.xilinx.com/support/packagefiles/z7packages/xc7z045ffg900pkg.txt; ComponentLink5Description: Packaging and Pinout; ComponentLink5URL: http://www.xilinx.com/support/documentation/user_guides/ug865-Zynq-7000-Pkg-Pinout.pdf; ComponentLink6Description: PCB and Layout Guide; ComponentLink6URL: http://www.xilinx.com/support/documentation/user_guides/ug483_7Series_PCB.pdf
R200 = R0603-100R/1%: Manufacturer: YAGEO; Manufacturer_p/n: RC0603FR-07100R; Part_number: R0603-100R/1%; Part_type: RES; Value: R0603-100R/1%; Schematic_Part: RES; PCB_Footprint: R0603; Manufacturer_p/n2: SAMSUNG; datasheet: Datasheet\R_YAGEO#Datasheet\R_YAGEO#
D12 = MAX3491ESD: Part_number: MAX3491ESD

## Sheet Z7_FUNCTION3.SchDoc
size A3
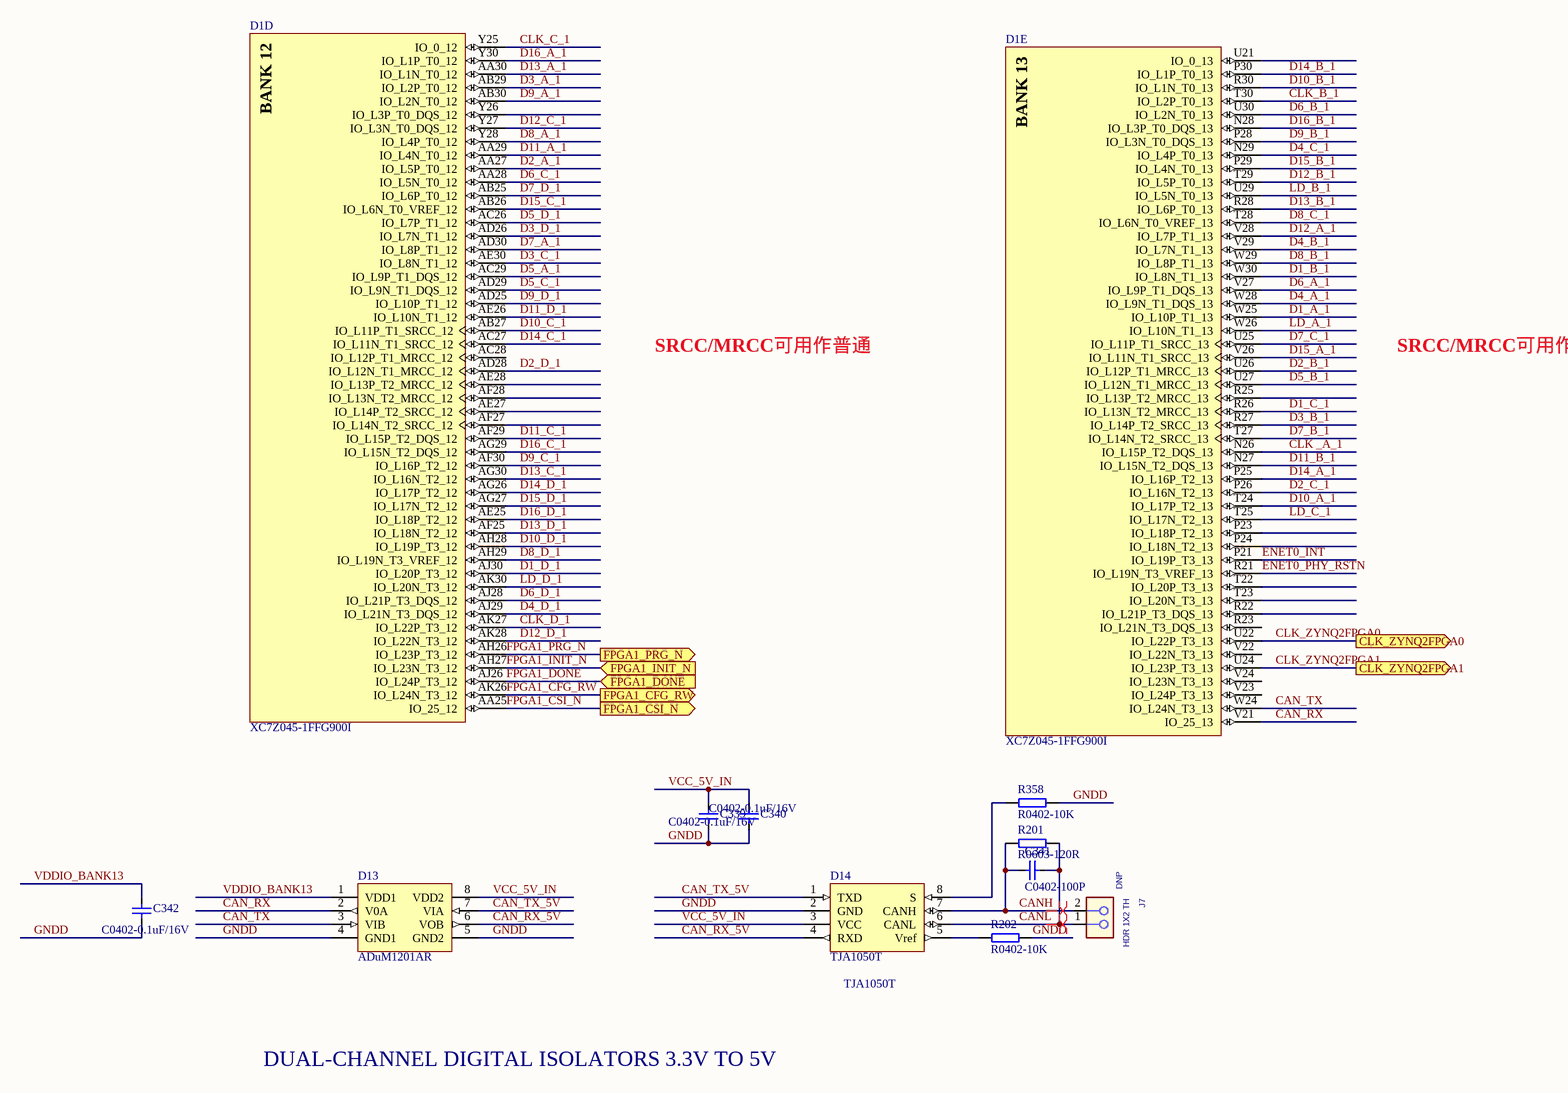
[diagram p35: Z7_FUNCTION3.SchDoc]

### Parts
C339  C0402-0.1uF/16V  [C0402]
C340  C0402-0.1uF/16V  [C0402]
C341  C0402-100P  [C0402]
C342  C0402-0.1uF/16V  [C0402]
D1  XC7Z045-1FFG900I  [FFG900]  (parts D,E of 16)
D13  ADuM1201AR  [SOIC-8]
D14  TJA1050T  [SOIC-8]
J7  HDR 1X2 TH  ASSY_OPT: DNP  [HDR102]
R201  R0603-120R  [R0603]
R202  R0402-10K  [R0402]
R358  R0402-10K  [R0402]

### Ports
CLK_ZYNQ2FPGA0 (out), CLK_ZYNQ2FPGA1 (out), FPGA1_CFG_RW (out), FPGA1_CSI_N (out), FPGA1_DONE (in), FPGA1_INIT_N (in), FPGA1_PRG_N (out)

### Nets
GNDD: C339.1 C340.1 C342.1 D13.4(GND1) D13.5(GND2) D14.2(GND) R202.2 R358.2
VDDIO_BANK13: C342.2 D13.1(VDD1)  [project net VCC3V3]
CAN_RX: D1.V21(IO_25_13) D13.2(V0A)
CAN_RX_5V: D13.6(VOB) D14.4(RXD)
CAN_TX: D1.W24(IO_L24N_T3_13) D13.3(VIB)
CAN_TX_5V: D13.7(VIA) D14.1(TXD)
CANH: C341.1 D14.7(CANH) J7.2 R201.2
CANL: C341.2 D14.6(CANL) J7.1 R201.1
CLK _A_1: D1.N26(IO_L15P_T2_DQS_13)
CLK_B_1: D1.T30(IO_L2P_T0_13)
CLK_C_1: D1.Y25(IO_0_12)
CLK_D_1: D1.AK27(IO_L22P_T3_12)
CLK_ZYNQ2FPGA0: D1.U22(IO_L22P_T3_13) ; port CLK_ZYNQ2FPGA0
CLK_ZYNQ2FPGA1: D1.U24(IO_L23P_T3_13) ; port CLK_ZYNQ2FPGA1
D1_A_1: D1.W25(IO_L10P_T1_13)
D1_B_1: D1.W30(IO_L8N_T1_13)
D1_C_1: D1.R26(IO_L13N_T2_MRCC_13)
D1_D_1: D1.AJ30(IO_L20P_T3_12)
D2_A_1: D1.AA27(IO_L5P_T0_12)
D2_B_1: D1.U26(IO_L12P_T1_MRCC_13)
D2_C_1: D1.P26(IO_L16N_T2_13)
D2_D_1: D1.AD28(IO_L12N_T1_MRCC_12)
D3_A_1: D1.AB29(IO_L2P_T0_12)
D3_B_1: D1.R27(IO_L14P_T2_SRCC_13)
D3_C_1: D1.AE30(IO_L8N_T1_12)
D3_D_1: D1.AD26(IO_L7N_T1_12)
D4_A_1: D1.W28(IO_L9N_T1_DQS_13)
D4_B_1: D1.V29(IO_L7N_T1_13)
D4_C_1: D1.N29(IO_L4P_T0_13)
D4_D_1: D1.AJ29(IO_L21N_T3_DQS_12)
D5_A_1: D1.AC29(IO_L9P_T1_DQS_12)
D5_B_1: D1.U27(IO_L12N_T1_MRCC_13)
D5_C_1: D1.AD29(IO_L9N_T1_DQS_12)
D5_D_1: D1.AC26(IO_L7P_T1_12)
D6_A_1: D1.V27(IO_L9P_T1_DQS_13)
D6_B_1: D1.U30(IO_L2N_T0_13)
D6_C_1: D1.AA28(IO_L5N_T0_12)
D6_D_1: D1.AJ28(IO_L21P_T3_DQS_12)
D7_A_1: D1.AD30(IO_L8P_T1_12)
D7_B_1: D1.T27(IO_L14N_T2_SRCC_13)
D7_C_1: D1.U25(IO_L11P_T1_SRCC_13)
D7_D_1: D1.AB25(IO_L6P_T0_12)
D8_A_1: D1.Y28(IO_L4P_T0_12)
D8_B_1: D1.W29(IO_L8P_T1_13)
D8_C_1: D1.T28(IO_L6N_T0_VREF_13)
D8_D_1: D1.AH29(IO_L19N_T3_VREF_12)
D9_A_1: D1.AB30(IO_L2N_T0_12)
D9_B_1: D1.P28(IO_L3N_T0_DQS_13)
D9_C_1: D1.AF30(IO_L16P_T2_12)
D9_D_1: D1.AD25(IO_L10P_T1_12)
D10_A_1: D1.T24(IO_L17P_T2_13)
D10_B_1: D1.R30(IO_L1N_T0_13)
D10_C_1: D1.AB27(IO_L11P_T1_SRCC_12)
D10_D_1: D1.AH28(IO_L19P_T3_12)
D11_A_1: D1.AA29(IO_L4N_T0_12)
D11_B_1: D1.N27(IO_L15N_T2_DQS_13)
D11_C_1: D1.AF29(IO_L15P_T2_DQS_12)
D11_D_1: D1.AE26(IO_L10N_T1_12)
D12_A_1: D1.V28(IO_L7P_T1_13)
D12_B_1: D1.T29(IO_L5P_T0_13)
D12_C_1: D1.Y27(IO_L3N_T0_DQS_12)
D12_D_1: D1.AK28(IO_L22N_T3_12)
D13_A_1: D1.AA30(IO_L1N_T0_12)
D13_B_1: D1.R28(IO_L6P_T0_13)
D13_C_1: D1.AG30(IO_L16N_T2_12)
D13_D_1: D1.AF25(IO_L18N_T2_12)
D14_A_1: D1.P25(IO_L16P_T2_13)
D14_B_1: D1.P30(IO_L1P_T0_13)
D14_C_1: D1.AC27(IO_L11N_T1_SRCC_12)
D14_D_1: D1.AG26(IO_L17P_T2_12)
D15_A_1: D1.V26(IO_L11N_T1_SRCC_13)
D15_B_1: D1.P29(IO_L4N_T0_13)
D15_C_1: D1.AB26(IO_L6N_T0_VREF_12)
D15_D_1: D1.AG27(IO_L17N_T2_12)
D16_A_1: D1.Y30(IO_L1P_T0_12)
D16_B_1: D1.N28(IO_L3P_T0_DQS_13)
D16_C_1: D1.AG29(IO_L15N_T2_DQS_12)
D16_D_1: D1.AE25(IO_L18P_T2_12)
ENET0_INT: D1.P21(IO_L19P_T3_13)
ENET0_PHY_RSTN: D1.R21(IO_L19N_T3_VREF_13)
FPGA1_CFG_RW: D1.AK26(IO_L24N_T3_12) ; port FPGA1_CFG_RW
FPGA1_CSI_N: D1.AA25(IO_25_12) ; port FPGA1_CSI_N
FPGA1_DONE: D1.AJ26(IO_L24P_T3_12) ; port FPGA1_DONE
FPGA1_INIT_N: D1.AH27(IO_L23N_T3_12) ; port FPGA1_INIT_N
FPGA1_PRG_N: D1.AH26(IO_L23P_T3_12) ; port FPGA1_PRG_N
LD_A_1: D1.W26(IO_L10N_T1_13)
LD_B_1: D1.U29(IO_L5N_T0_13)
LD_C_1: D1.T25(IO_L17N_T2_13)
LD_D_1: D1.AK30(IO_L20N_T3_12)
VCC_5V_IN: C339.2 C340.2 D13.8(VDD2) D14.3(VCC)
NetD14_5: D14.5(Vref) R202.1
NetD14_8: D14.8(S) R358.1

Not connected (* = marked no-connect by the designer): D1 AC28(IO_L12P_T1_MRCC_12) AE27(IO_L14P_T2_SRCC_12) AE28(IO_L13P_T2_MRCC_12) AF27(IO_L14N_T2_SRCC_12) AF28(IO_L13N_T2_MRCC_12) P23(IO_L18P_T2_13) P24(IO_L18N_T2_13) R22(IO_L21P_T3_DQS_13) R23(IO_L21N_T3_DQS_13) R25(IO_L13P_T2_MRCC_13) T22(IO_L20P_T3_13) T23(IO_L20N_T3_13) U21(IO_0_13) V22(IO_L22N_T3_13) V23(IO_L24P_T3_13) V24(IO_L23N_T3_13) Y26(IO_L3P_T0_DQS_12)

### Layout directives
differential pair: CANH, CANL

### Notes on the sheet
- SRCC/MRCC可用作普通
- DUAL-CHANNEL DIGITAL ISOLATORS 3.3V TO 5V
- (in symbol XC7Z045-1FFG900I, part D) BANK 12
- (in symbol XC7Z045-1FFG900I, part E) BANK 13

### Library data of the parts
C339-C342 = C0402-0.1uF/16V: as C336 on sheet Z7_FUNCTION2; Part_type: CAP; temperature: -55℃\+125℃; Schematic_Part: CAP; PCB_Footprint: C0402; datasheet: #DataSheet\C_Samsung_General Capacitors.pdf#
  C339 C340 C342: Part_number: C0402-0.1uF/16V; Value: C0402-0.1uF/16V
  C341: Part_number: C0402-100P; Value: C0402-100P
D1 = XC7Z045-1FFG900I: as D1 on sheet Z7_MGTX; DatasheetVersion: v1.2; PackageVersion: Rev 1.1; PackageReference: FFG900; PackageDescription: Flip-Chip BGA, Body 31 x 31 mm, 1.0 mm Pitch; Generic Part Number: XC7Z045; RoHS: Pb-Free; Mounting Technology: Surface Mount; Code_JEDEC: MS-034-AAN-1; PartNumber: XC7Z045-1FFG900I; ComponentLink1Description: Datasheet; ComponentLink1URL: http://www.xilinx.com/support/documentation/data_sheets/ds190-Zynq-7000-Overview.pdf; ComponentLink2Description: Package Specification; ComponentLink2URL: http://www.xilinx.com/support/documentation/user_guides/ug865-Zynq-7000-Pkg-Pinout.pdf; ComponentLink3Description: DC and AC Switching Characteristics; ComponentLink3URL: http://www.xilinx.com/support/documentation/data_sheets/ds191-XC7Z030-XC7Z045-data-sheet.pdf; ComponentLink4Description: Package File; ComponentLink4URL: http://www.xilinx.com/support/packagefiles/z7packages/xc7z045ffg900pkg.txt; ComponentLink5Description: Packaging and Pinout; ComponentLink5URL: http://www.xilinx.com/support/documentation/user_guides/ug865-Zynq-7000-Pkg-Pinout.pdf; ComponentLink6Description: PCB and Layout Guide; ComponentLink6URL: http://www.xilinx.com/support/documentation/user_guides/ug483_7Series_PCB.pdf
D13 = ADuM1201AR: Quad-Channel Digital Isolators; Part_type: IC-SMD; Part_number: ADuM1201AR; Value: ADuM1201AR; Schematic_Part: ADuM1201AR; PCB_Footprint: SOIC-8
D14 = TJA1050T: 以太网芯片，high speed CAN transceiver,3.3V,SO-8PIN; Part_type: IC-SMD; Manufacturer: PHILIPS; Part_number: TJA1050T; Value: TJA1050T; Temperature: -40℃\+125℃; Schematic_Part: TJA1050; PCB_Footprint: SOIC-8; datasheet: #Datasheet\IC_PHILIPS_TJA1050T.pdf#
J7 = CONN_HDR_2X1: HDR 1X2 TH 100MIL SP 339H AU 98L; CLASS: IO; CAD_APPROVED: YES; MFG_PN01: TSW-102-07-G-S; MFG_NAME01: SAMTEC; AGILE_PN: 210-75439; HEIGHT: 8.71 MM; ROHS: Yes
R201 = R0603-100R/1%: as R200 on sheet Z7_FUNCTION2; Part_number: R0603-120R; Part_type: RES; Value: R0603-120R; Schematic_Part: RES; PCB_Footprint: R0603; Manufacturer_p/n2: SAMSUNG; datasheet: Datasheet\R_YAGEO#Datasheet\R_YAGEO#
R202 R358 = R0402-10K: Manufacturer: SAMSUNG; Part_number: R0402-10K; Part_type: RES; Value: R0402-10K; Schematic_Part: RES; PCB_Footprint: R0402

## Sheet ZYNQ_reset.SchDoc
size A4
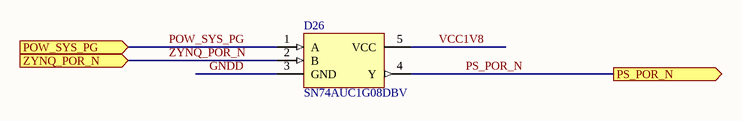
[diagram p36: ZYNQ_reset.SchDoc]

### Parts
D26  SN74AUC1G08DBV  [SOT-23-5]

### Ports
POW_SYS_PG (in), PS_POR_N (out), ZYNQ_POR_N (in)

### Nets
GNDD: D26.3(GND)
VCC1V8: D26.5(VCC)
POW_SYS_PG: D26.1(A) ; port POW_SYS_PG
PS_POR_N: D26.4(Y) ; port PS_POR_N
ZYNQ_POR_N: D26.2(B) ; port ZYNQ_POR_N

## Sheet 外围电路.SchDoc
size A4
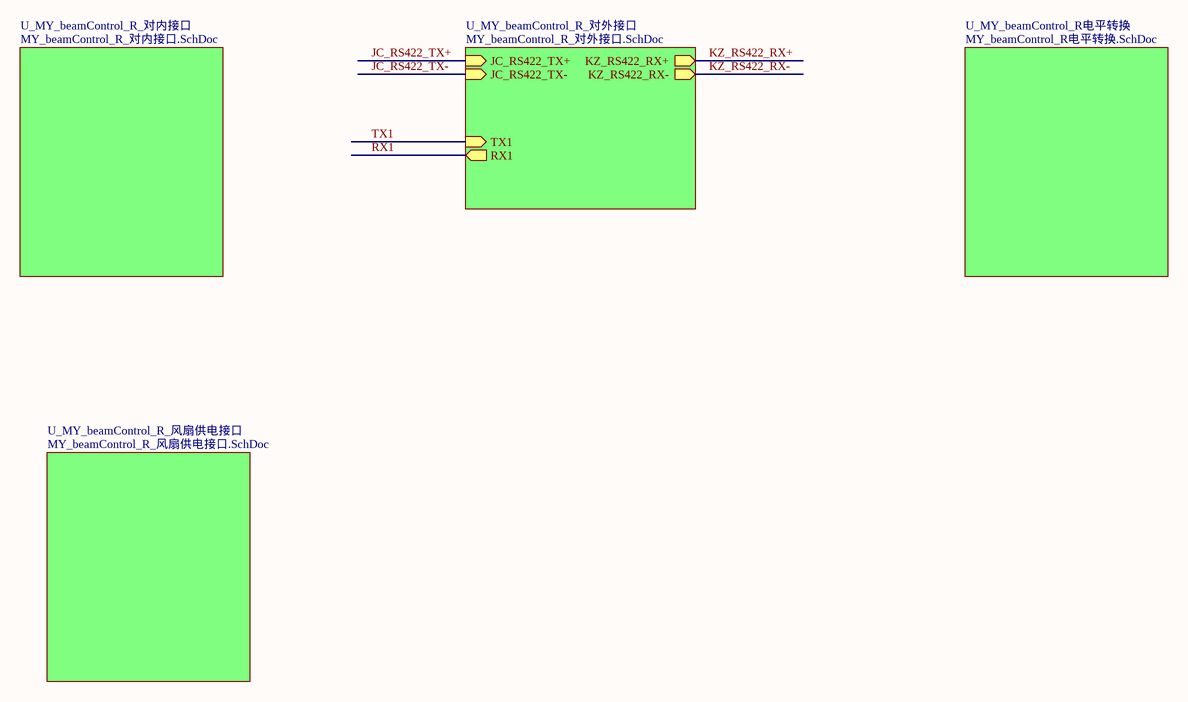
[diagram p37: 外围电路.SchDoc]

### Sub-sheets
U_MY_beamControl_R_对内接口 = MY_beamControl_R_对内接口.SchDoc: no entries
U_MY_beamControl_R_对外接口 = MY_beamControl_R_对外接口.SchDoc: JC_RS422_TX+ (in), JC_RS422_TX- (in), KZ_RS422_RX+ (out), KZ_RS422_RX- (out), RX1 (out), TX1 (in)
U_MY_beamControl_R_风扇供电接口 = MY_beamControl_R_风扇供电接口.SchDoc: no entries
U_MY_beamControl_R电平转换 = MY_beamControl_R电平转换.SchDoc: no entries

## Sheet MY_beamControl_R_对内接口.SchDoc
size A2; PageSetup: Record=PageOptions?CenterHorizontal=True?CenterVertical=True?PrintScale=0.73?XCorrection=1.00?YCorrection=1.00?PrintKind=1?BorderSize=5000000?LeftOffset=0?BottomOffset=0?Orientation=2?PaperLength=4200?PaperWidth=2970?Scale=100?PaperSource=7?PrintQuality=-4?MediaType=1?DitherType=10?PaperKind=A3?PrintScaleMode=1
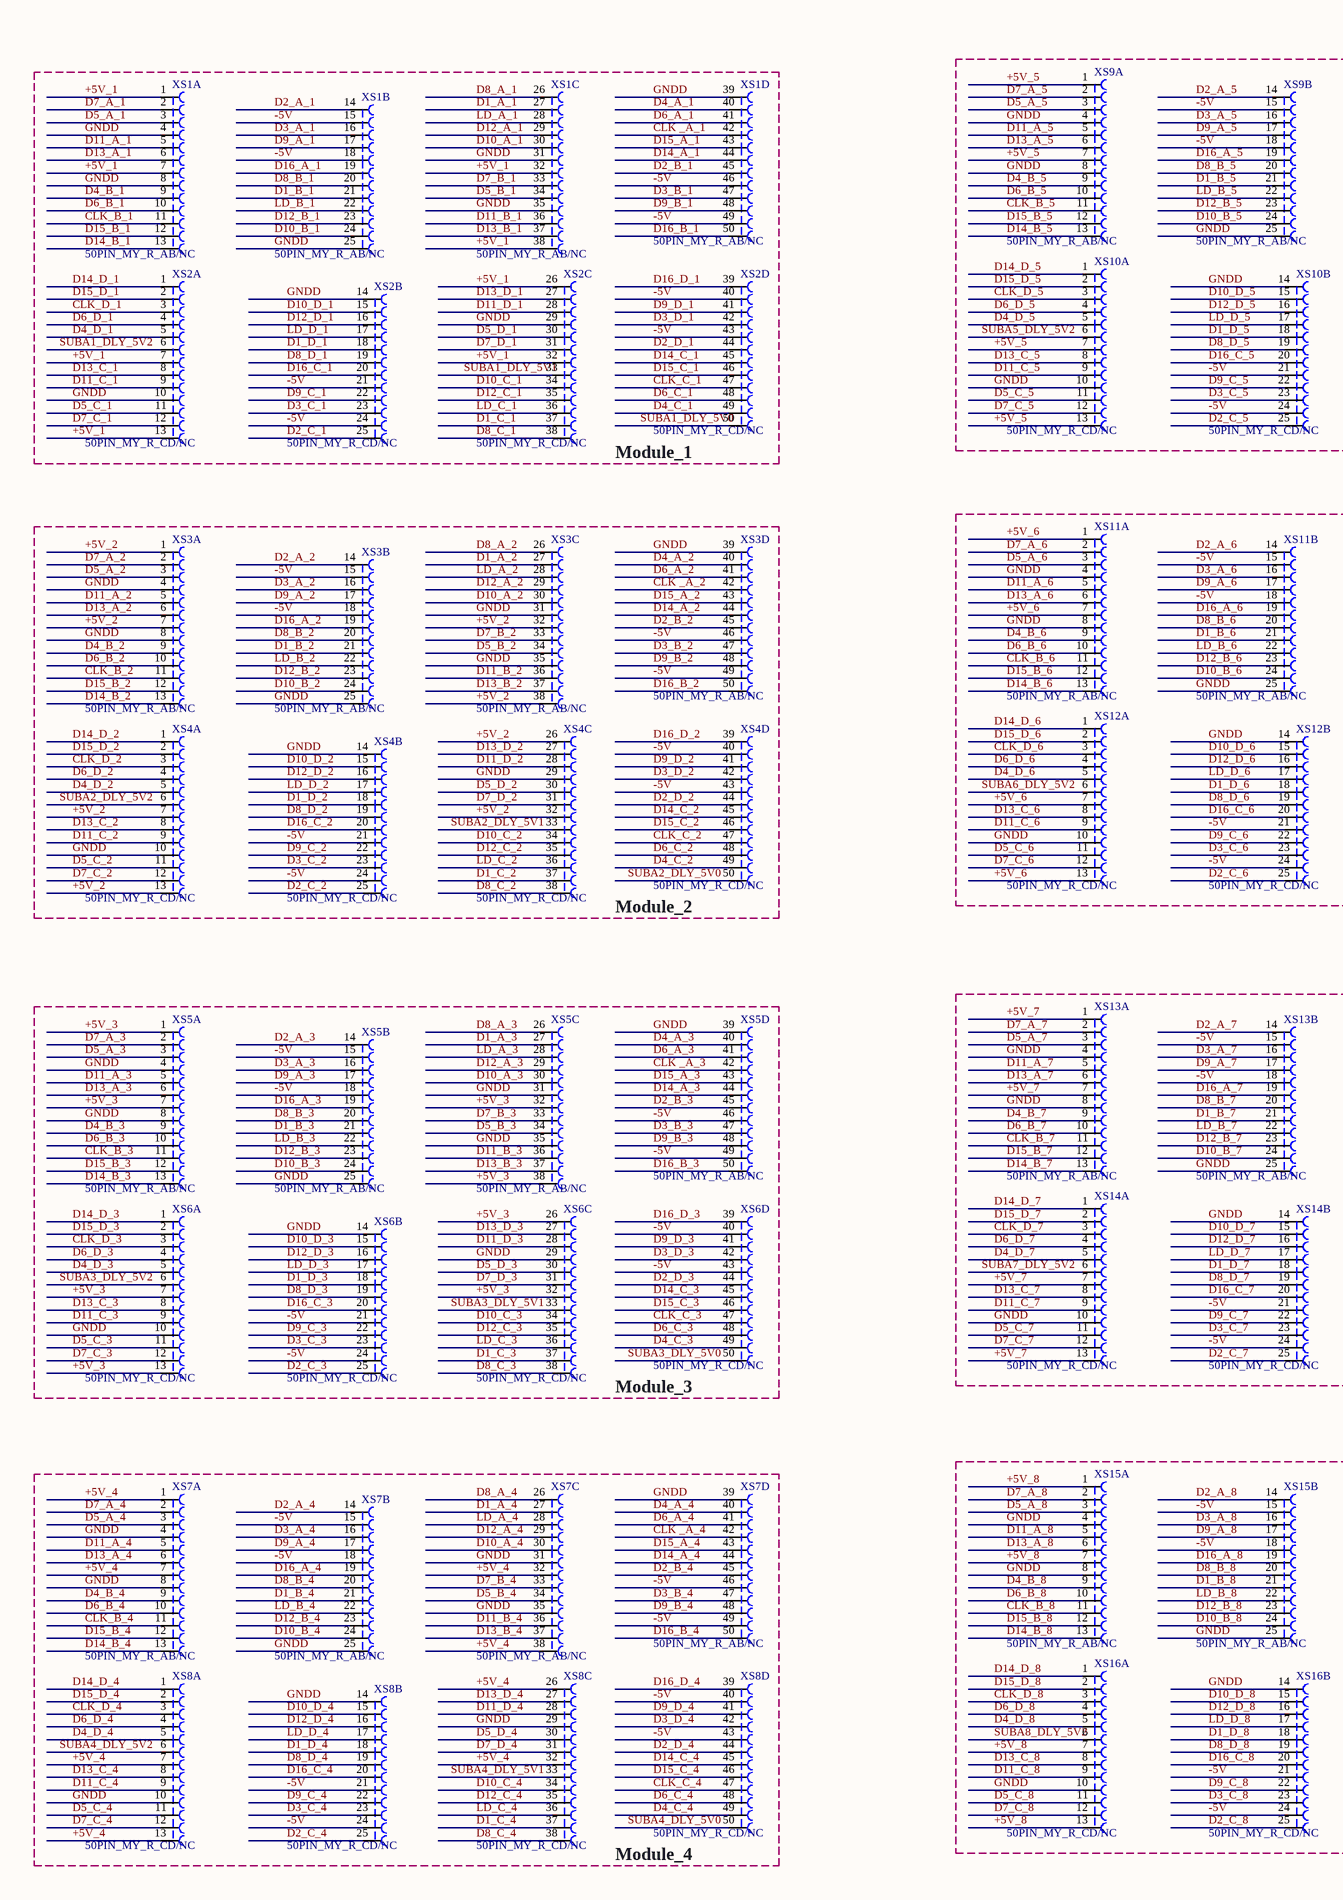
[diagram p38: MY_beamControl_R_对内接口.SchDoc, left]
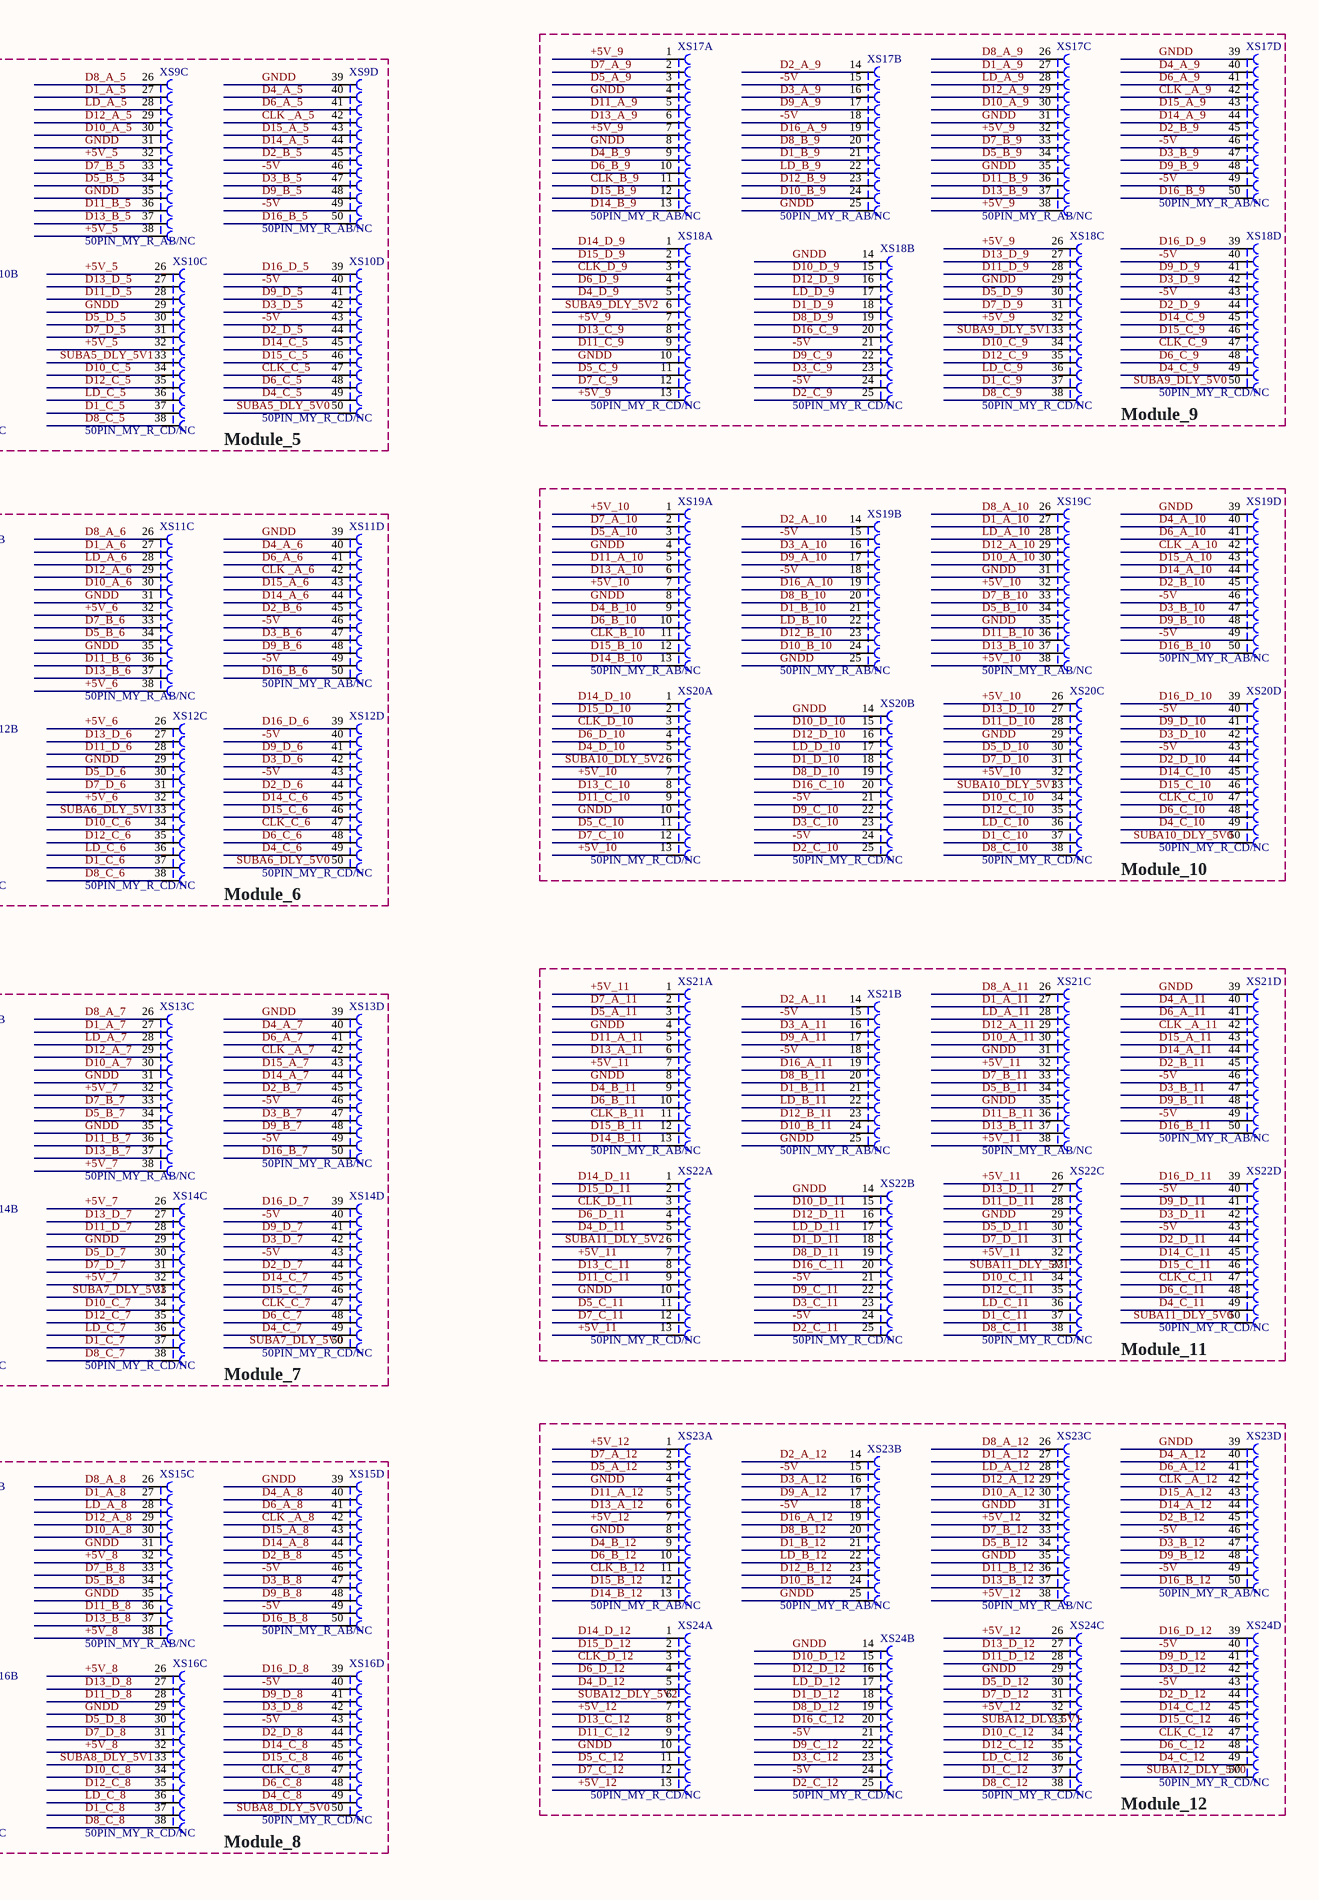
[diagram p39: MY_beamControl_R_对内接口.SchDoc, right]

### Parts
XS1  50PIN_MY_R_AB/NC  [PIN50_MY]  (parts A,B,C,D of 4)
XS2  50PIN_MY_R_CD/NC  [PIN50_MY]  (parts A,B,C,D of 4)
XS3  50PIN_MY_R_AB/NC  [PIN50_MY]  (parts A,B,C,D of 4)
XS4  50PIN_MY_R_CD/NC  [PIN50_MY]  (parts A,B,C,D of 4)
XS5  50PIN_MY_R_AB/NC  [PIN50_MY]  (parts A,B,C,D of 4)
XS6  50PIN_MY_R_CD/NC  [PIN50_MY]  (parts A,B,C,D of 4)
XS7  50PIN_MY_R_AB/NC  [PIN50_MY]  (parts A,B,C,D of 4)
XS8  50PIN_MY_R_CD/NC  [PIN50_MY]  (parts A,B,C,D of 4)
XS9  50PIN_MY_R_AB/NC  [PIN50_MY]  (parts A,B,C,D of 4)
XS10  50PIN_MY_R_CD/NC  [PIN50_MY]  (parts A,B,C,D of 4)
XS11  50PIN_MY_R_AB/NC  [PIN50_MY]  (parts A,B,C,D of 4)
XS12  50PIN_MY_R_CD/NC  [PIN50_MY]  (parts A,B,C,D of 4)
XS13  50PIN_MY_R_AB/NC  [PIN50_MY]  (parts A,B,C,D of 4)
XS14  50PIN_MY_R_CD/NC  [PIN50_MY]  (parts A,B,C,D of 4)
XS15  50PIN_MY_R_AB/NC  [PIN50_MY]  (parts A,B,C,D of 4)
XS16  50PIN_MY_R_CD/NC  [PIN50_MY]  (parts A,B,C,D of 4)
XS17  50PIN_MY_R_AB/NC  [PIN50_MY]  (parts A,B,C,D of 4)
XS18  50PIN_MY_R_CD/NC  [PIN50_MY]  (parts A,B,C,D of 4)
XS19  50PIN_MY_R_AB/NC  [PIN50_MY]  (parts A,B,C,D of 4)
XS20  50PIN_MY_R_CD/NC  [PIN50_MY]  (parts A,B,C,D of 4)
XS21  50PIN_MY_R_AB/NC  [PIN50_MY]  (parts A,B,C,D of 4)
XS22  50PIN_MY_R_CD/NC  [PIN50_MY]  (parts A,B,C,D of 4)
XS23  50PIN_MY_R_AB/NC  [PIN50_MY]  (parts A,B,C,D of 4)
XS24  50PIN_MY_R_CD/NC  [PIN50_MY]  (parts A,B,C,D of 4)

### Blocks framed on the sheet
Module_1: XS1 XS2
Module_5: XS9 XS10
Module_9: XS17 XS18
Module_6: XS11 XS12
Module_10: XS19 XS20
Module_2: XS3 XS4
Module_11: XS21 XS22
Module_3: XS5 XS6
Module_7: XS13 XS14
Module_12: XS23 XS24
Module_4: XS7 XS8
Module_8: XS15 XS16

### Nets
GNDD: XS1.4 XS1.8 XS1.25 XS1.31 XS1.35 XS1.39 XS2.10 XS2.14 XS2.29 XS3.4 XS3.8 XS3.25 XS3.31 XS3.35 XS3.39 XS4.10 XS4.14 XS4.29 XS5.4 XS5.8 XS5.25 XS5.31 XS5.35 XS5.39 XS6.10 XS6.14 XS6.29 XS7.4 XS7.8 XS7.25 XS7.31 XS7.35 XS7.39 XS8.10 XS8.14 XS8.29 XS9.4 XS9.8 XS9.25 XS9.31 XS9.35 XS9.39 XS10.10 XS10.14 XS10.29 XS11.4 XS11.8 XS11.25 XS11.31 XS11.35 XS11.39 XS12.10 XS12.14 XS12.29 XS13.4 XS13.8 XS13.25 XS13.31 XS13.35 XS13.39 XS14.10 XS14.14 XS14.29 XS15.4 XS15.8 XS15.25 XS15.31 XS15.35 XS15.39 XS16.10 XS16.14 XS16.29 XS17.4 XS17.8 XS17.25 XS17.31 XS17.35 XS17.39 XS18.10 XS18.14 XS18.29 XS19.4 XS19.8 XS19.25 XS19.31 XS19.35 XS19.39 XS20.10 XS20.14 XS20.29 XS21.4 XS21.8 XS21.25 XS21.31 XS21.35 XS21.39 XS22.10 XS22.14 XS22.29 XS23.4 XS23.8 XS23.25 XS23.31 XS23.35 XS23.39 XS24.10 XS24.14 XS24.29
+5V_1: XS1.1 XS1.7 XS1.32 XS1.38 XS2.7 XS2.13 XS2.26 XS2.32
+5V_2: XS3.1 XS3.7 XS3.32 XS3.38 XS4.7 XS4.13 XS4.26 XS4.32
+5V_3: XS5.1 XS5.7 XS5.32 XS5.38 XS6.7 XS6.13 XS6.26 XS6.32
+5V_4: XS7.1 XS7.7 XS7.32 XS7.38 XS8.7 XS8.13 XS8.26 XS8.32
+5V_5: XS9.1 XS9.7 XS9.32 XS9.38 XS10.7 XS10.13 XS10.26 XS10.32
+5V_6: XS11.1 XS11.7 XS11.32 XS11.38 XS12.7 XS12.13 XS12.26 XS12.32
+5V_7: XS13.1 XS13.7 XS13.32 XS13.38 XS14.7 XS14.13 XS14.26 XS14.32
+5V_8: XS15.1 XS15.7 XS15.32 XS15.38 XS16.7 XS16.13 XS16.26 XS16.32
+5V_9: XS17.1 XS17.7 XS17.32 XS17.38 XS18.7 XS18.13 XS18.26 XS18.32
+5V_10: XS19.1 XS19.7 XS19.32 XS19.38 XS20.7 XS20.13 XS20.26 XS20.32
+5V_11: XS21.1 XS21.7 XS21.32 XS21.38 XS22.7 XS22.13 XS22.26 XS22.32
+5V_12: XS23.1 XS23.7 XS23.32 XS23.38 XS24.7 XS24.13 XS24.26 XS24.32
-5V: XS1.15 XS1.18 XS1.46 XS1.49 XS2.21 XS2.24 XS2.40 XS2.43 XS3.15 XS3.18 XS3.46 XS3.49 XS4.21 XS4.24 XS4.40 XS4.43 XS5.15 XS5.18 XS5.46 XS5.49 XS6.21 XS6.24 XS6.40 XS6.43 XS7.15 XS7.18 XS7.46 XS7.49 XS8.21 XS8.24 XS8.40 XS8.43 XS9.15 XS9.18 XS9.46 XS9.49 XS10.21 XS10.24 XS10.40 XS10.43 XS11.15 XS11.18 XS11.46 XS11.49 XS12.21 XS12.24 XS12.40 XS12.43 XS13.15 XS13.18 XS13.46 XS13.49 XS14.21 XS14.24 XS14.40 XS14.43 XS15.15 XS15.18 XS15.46 XS15.49 XS16.21 XS16.24 XS16.40 XS16.43 XS17.15 XS17.18 XS17.46 XS17.49 XS18.21 XS18.24 XS18.40 XS18.43 XS19.15 XS19.18 XS19.46 XS19.49 XS20.21 XS20.24 XS20.40 XS20.43 XS21.15 XS21.18 XS21.46 XS21.49 XS22.21 XS22.24 XS22.40 XS22.43 XS23.15 XS23.18 XS23.46 XS23.49 XS24.21 XS24.24 XS24.40 XS24.43
CLK _A_1: XS1.42
CLK _A_2: XS3.42
CLK _A_3: XS5.42
CLK _A_4: XS7.42
CLK _A_5: XS9.42
CLK _A_6: XS11.42
CLK _A_7: XS13.42
CLK _A_8: XS15.42
CLK _A_9: XS17.42
CLK _A_10: XS19.42
CLK _A_11: XS21.42
CLK _A_12: XS23.42
CLK_B_1: XS1.11
CLK_B_2: XS3.11
CLK_B_3: XS5.11
CLK_B_4: XS7.11
CLK_B_5: XS9.11
CLK_B_6: XS11.11
CLK_B_7: XS13.11
CLK_B_8: XS15.11
CLK_B_9: XS17.11
CLK_B_10: XS19.11
CLK_B_11: XS21.11
CLK_B_12: XS23.11
CLK_C_1: XS2.47
CLK_C_2: XS4.47
CLK_C_3: XS6.47
CLK_C_4: XS8.47
CLK_C_5: XS10.47
CLK_C_6: XS12.47
CLK_C_7: XS14.47
CLK_C_8: XS16.47
CLK_C_9: XS18.47
CLK_C_10: XS20.47
CLK_C_11: XS22.47
CLK_C_12: XS24.47
CLK_D_1: XS2.3
CLK_D_2: XS4.3
CLK_D_3: XS6.3
CLK_D_4: XS8.3
CLK_D_5: XS10.3
CLK_D_6: XS12.3
CLK_D_7: XS14.3
CLK_D_8: XS16.3
CLK_D_9: XS18.3
CLK_D_10: XS20.3
CLK_D_11: XS22.3
CLK_D_12: XS24.3
D1_A_1: XS1.27
D1_A_2: XS3.27
D1_A_3: XS5.27
D1_A_4: XS7.27
D1_A_5: XS9.27
D1_A_6: XS11.27
D1_A_7: XS13.27
D1_A_8: XS15.27
D1_A_9: XS17.27
D1_A_10: XS19.27
D1_A_11: XS21.27
D1_A_12: XS23.27
D1_B_1: XS1.21
D1_B_2: XS3.21
D1_B_3: XS5.21
D1_B_4: XS7.21
D1_B_5: XS9.21
D1_B_6: XS11.21
D1_B_7: XS13.21
D1_B_8: XS15.21
D1_B_9: XS17.21
D1_B_10: XS19.21
D1_B_11: XS21.21
D1_B_12: XS23.21
D1_C_1: XS2.37
D1_C_2: XS4.37
D1_C_3: XS6.37
D1_C_4: XS8.37
D1_C_5: XS10.37
D1_C_6: XS12.37
D1_C_7: XS14.37
D1_C_8: XS16.37
D1_C_9: XS18.37
D1_C_10: XS20.37
D1_C_11: XS22.37
D1_C_12: XS24.37
D1_D_1: XS2.18
D1_D_2: XS4.18
D1_D_3: XS6.18
D1_D_4: XS8.18
D1_D_5: XS10.18
D1_D_6: XS12.18
D1_D_7: XS14.18
D1_D_8: XS16.18
D1_D_9: XS18.18
D1_D_10: XS20.18
D1_D_11: XS22.18
D1_D_12: XS24.18
D2_A_1: XS1.14
D2_A_2: XS3.14
D2_A_3: XS5.14
D2_A_4: XS7.14
D2_A_5: XS9.14
D2_A_6: XS11.14
D2_A_7: XS13.14
D2_A_8: XS15.14
D2_A_9: XS17.14
D2_A_10: XS19.14
D2_A_11: XS21.14
D2_A_12: XS23.14
D2_B_1: XS1.45
D2_B_2: XS3.45
D2_B_3: XS5.45
D2_B_4: XS7.45
D2_B_5: XS9.45
D2_B_6: XS11.45
D2_B_7: XS13.45
D2_B_8: XS15.45
D2_B_9: XS17.45
D2_B_10: XS19.45
D2_B_11: XS21.45
D2_B_12: XS23.45
D2_C_1: XS2.25
D2_C_2: XS4.25
D2_C_3: XS6.25
D2_C_4: XS8.25
D2_C_5: XS10.25
D2_C_6: XS12.25
D2_C_7: XS14.25
D2_C_8: XS16.25
D2_C_9: XS18.25
D2_C_10: XS20.25
D2_C_11: XS22.25
D2_C_12: XS24.25
D2_D_1: XS2.44
D2_D_2: XS4.44
D2_D_3: XS6.44
D2_D_4: XS8.44
D2_D_5: XS10.44
D2_D_6: XS12.44
D2_D_7: XS14.44
D2_D_8: XS16.44
D2_D_9: XS18.44
D2_D_10: XS20.44
D2_D_11: XS22.44
D2_D_12: XS24.44
D3_A_1: XS1.16
D3_A_2: XS3.16
D3_A_3: XS5.16
D3_A_4: XS7.16
D3_A_5: XS9.16
D3_A_6: XS11.16
D3_A_7: XS13.16
D3_A_8: XS15.16
D3_A_9: XS17.16
D3_A_10: XS19.16
D3_A_11: XS21.16
D3_A_12: XS23.16
D3_B_1: XS1.47
D3_B_2: XS3.47
D3_B_3: XS5.47
D3_B_4: XS7.47
D3_B_5: XS9.47
D3_B_6: XS11.47
D3_B_7: XS13.47
D3_B_8: XS15.47
D3_B_9: XS17.47
D3_B_10: XS19.47
D3_B_11: XS21.47
D3_B_12: XS23.47
D3_C_1: XS2.23
D3_C_2: XS4.23
D3_C_3: XS6.23
D3_C_4: XS8.23
D3_C_5: XS10.23
D3_C_6: XS12.23
D3_C_7: XS14.23
D3_C_8: XS16.23
D3_C_9: XS18.23
D3_C_10: XS20.23
D3_C_11: XS22.23
D3_C_12: XS24.23
D3_D_1: XS2.42
D3_D_2: XS4.42
D3_D_3: XS6.42
D3_D_4: XS8.42
D3_D_5: XS10.42
D3_D_6: XS12.42
D3_D_7: XS14.42
D3_D_8: XS16.42
D3_D_9: XS18.42
D3_D_10: XS20.42
D3_D_11: XS22.42
D3_D_12: XS24.42
D4_A_1: XS1.40
D4_A_2: XS3.40
D4_A_3: XS5.40
D4_A_4: XS7.40
D4_A_5: XS9.40
D4_A_6: XS11.40
D4_A_7: XS13.40
D4_A_8: XS15.40
D4_A_9: XS17.40
D4_A_10: XS19.40
D4_A_11: XS21.40
D4_A_12: XS23.40
D4_B_1: XS1.9
D4_B_2: XS3.9
D4_B_3: XS5.9
D4_B_4: XS7.9
D4_B_5: XS9.9
D4_B_6: XS11.9
D4_B_7: XS13.9
D4_B_8: XS15.9
D4_B_9: XS17.9
D4_B_10: XS19.9
D4_B_11: XS21.9
D4_B_12: XS23.9
D4_C_1: XS2.49
D4_C_2: XS4.49
D4_C_3: XS6.49
D4_C_4: XS8.49
D4_C_5: XS10.49
D4_C_6: XS12.49
D4_C_7: XS14.49
D4_C_8: XS16.49
D4_C_9: XS18.49
D4_C_10: XS20.49
D4_C_11: XS22.49
D4_C_12: XS24.49
D4_D_1: XS2.5
D4_D_2: XS4.5
D4_D_3: XS6.5
D4_D_4: XS8.5
D4_D_5: XS10.5
D4_D_6: XS12.5
D4_D_7: XS14.5
D4_D_8: XS16.5
D4_D_9: XS18.5
D4_D_10: XS20.5
D4_D_11: XS22.5
D4_D_12: XS24.5
D5_A_1: XS1.3
D5_A_2: XS3.3
D5_A_3: XS5.3
D5_A_4: XS7.3
D5_A_5: XS9.3
D5_A_6: XS11.3
D5_A_7: XS13.3
D5_A_8: XS15.3
D5_A_9: XS17.3
D5_A_10: XS19.3
D5_A_11: XS21.3
D5_A_12: XS23.3
D5_B_1: XS1.34
D5_B_2: XS3.34
D5_B_3: XS5.34
D5_B_4: XS7.34
D5_B_5: XS9.34
D5_B_6: XS11.34
D5_B_7: XS13.34
D5_B_8: XS15.34
D5_B_9: XS17.34
D5_B_10: XS19.34
D5_B_11: XS21.34
D5_B_12: XS23.34
D5_C_1: XS2.11
D5_C_2: XS4.11
D5_C_3: XS6.11
D5_C_4: XS8.11
D5_C_5: XS10.11
D5_C_6: XS12.11
D5_C_7: XS14.11
D5_C_8: XS16.11
D5_C_9: XS18.11
D5_C_10: XS20.11
D5_C_11: XS22.11
D5_C_12: XS24.11
D5_D_1: XS2.30
D5_D_2: XS4.30
D5_D_3: XS6.30
D5_D_4: XS8.30
D5_D_5: XS10.30
D5_D_6: XS12.30
D5_D_7: XS14.30
D5_D_8: XS16.30
D5_D_9: XS18.30
D5_D_10: XS20.30
D5_D_11: XS22.30
D5_D_12: XS24.30
D6_A_1: XS1.41
D6_A_2: XS3.41
D6_A_3: XS5.41
D6_A_4: XS7.41
D6_A_5: XS9.41
D6_A_6: XS11.41
D6_A_7: XS13.41
D6_A_8: XS15.41
D6_A_9: XS17.41
D6_A_10: XS19.41
D6_A_11: XS21.41
D6_A_12: XS23.41
D6_B_1: XS1.10
D6_B_2: XS3.10
D6_B_3: XS5.10
D6_B_4: XS7.10
D6_B_5: XS9.10
D6_B_6: XS11.10
D6_B_7: XS13.10
D6_B_8: XS15.10
D6_B_9: XS17.10
D6_B_10: XS19.10
D6_B_11: XS21.10
D6_B_12: XS23.10
D6_C_1: XS2.48
D6_C_2: XS4.48
D6_C_3: XS6.48
D6_C_4: XS8.48
D6_C_5: XS10.48
D6_C_6: XS12.48
D6_C_7: XS14.48
D6_C_8: XS16.48
D6_C_9: XS18.48
D6_C_10: XS20.48
D6_C_11: XS22.48
D6_C_12: XS24.48
D6_D_1: XS2.4
D6_D_2: XS4.4
D6_D_3: XS6.4
D6_D_4: XS8.4
D6_D_5: XS10.4
D6_D_6: XS12.4
D6_D_7: XS14.4
D6_D_8: XS16.4
D6_D_9: XS18.4
D6_D_10: XS20.4
D6_D_11: XS22.4
D6_D_12: XS24.4
D7_A_1: XS1.2
D7_A_2: XS3.2
D7_A_3: XS5.2
D7_A_4: XS7.2
D7_A_5: XS9.2
D7_A_6: XS11.2
D7_A_7: XS13.2
D7_A_8: XS15.2
D7_A_9: XS17.2
D7_A_10: XS19.2
D7_A_11: XS21.2
D7_A_12: XS23.2
D7_B_1: XS1.33
D7_B_2: XS3.33
D7_B_3: XS5.33
D7_B_4: XS7.33
D7_B_5: XS9.33
D7_B_6: XS11.33
D7_B_7: XS13.33
D7_B_8: XS15.33
D7_B_9: XS17.33
D7_B_10: XS19.33
D7_B_11: XS21.33
D7_B_12: XS23.33
D7_C_1: XS2.12
D7_C_2: XS4.12
D7_C_3: XS6.12
D7_C_4: XS8.12
D7_C_5: XS10.12
D7_C_6: XS12.12
D7_C_7: XS14.12
D7_C_8: XS16.12
D7_C_9: XS18.12
D7_C_10: XS20.12
D7_C_11: XS22.12
D7_C_12: XS24.12
D7_D_1: XS2.31
D7_D_2: XS4.31
D7_D_3: XS6.31
D7_D_4: XS8.31
D7_D_5: XS10.31
D7_D_6: XS12.31
D7_D_7: XS14.31
D7_D_8: XS16.31
D7_D_9: XS18.31
D7_D_10: XS20.31
D7_D_11: XS22.31
D7_D_12: XS24.31
D8_A_1: XS1.26
D8_A_2: XS3.26
D8_A_3: XS5.26
D8_A_4: XS7.26
D8_A_5: XS9.26
D8_A_6: XS11.26
D8_A_7: XS13.26
D8_A_8: XS15.26
D8_A_9: XS17.26
D8_A_10: XS19.26
D8_A_11: XS21.26
D8_A_12: XS23.26
D8_B_1: XS1.20
D8_B_2: XS3.20
D8_B_3: XS5.20
D8_B_4: XS7.20
D8_B_5: XS9.20
D8_B_6: XS11.20
D8_B_7: XS13.20
D8_B_8: XS15.20
D8_B_9: XS17.20
D8_B_10: XS19.20
D8_B_11: XS21.20
D8_B_12: XS23.20
D8_C_1: XS2.38
D8_C_2: XS4.38
D8_C_3: XS6.38
D8_C_4: XS8.38
D8_C_5: XS10.38
D8_C_6: XS12.38
D8_C_7: XS14.38
D8_C_8: XS16.38
D8_C_9: XS18.38
D8_C_10: XS20.38
D8_C_11: XS22.38
D8_C_12: XS24.38
D8_D_1: XS2.19
D8_D_2: XS4.19
D8_D_3: XS6.19
D8_D_4: XS8.19
D8_D_5: XS10.19
D8_D_6: XS12.19
D8_D_7: XS14.19
D8_D_8: XS16.19
D8_D_9: XS18.19
D8_D_10: XS20.19
D8_D_11: XS22.19
D8_D_12: XS24.19
D9_A_1: XS1.17
D9_A_2: XS3.17
D9_A_3: XS5.17
D9_A_4: XS7.17
D9_A_5: XS9.17
D9_A_6: XS11.17
D9_A_7: XS13.17
D9_A_8: XS15.17
D9_A_9: XS17.17
D9_A_10: XS19.17
D9_A_11: XS21.17
D9_A_12: XS23.17
D9_B_1: XS1.48
D9_B_2: XS3.48
D9_B_3: XS5.48
D9_B_4: XS7.48
D9_B_5: XS9.48
D9_B_6: XS11.48
D9_B_7: XS13.48
D9_B_8: XS15.48
D9_B_9: XS17.48
D9_B_10: XS19.48
D9_B_11: XS21.48
D9_B_12: XS23.48
D9_C_1: XS2.22
D9_C_2: XS4.22
D9_C_3: XS6.22
D9_C_4: XS8.22
D9_C_5: XS10.22
D9_C_6: XS12.22
D9_C_7: XS14.22
D9_C_8: XS16.22
D9_C_9: XS18.22
D9_C_10: XS20.22
D9_C_11: XS22.22
D9_C_12: XS24.22
D9_D_1: XS2.41
D9_D_2: XS4.41
D9_D_3: XS6.41
D9_D_4: XS8.41
D9_D_5: XS10.41
D9_D_6: XS12.41
D9_D_7: XS14.41
D9_D_8: XS16.41
D9_D_9: XS18.41
D9_D_10: XS20.41
D9_D_11: XS22.41
D9_D_12: XS24.41
D10_A_1: XS1.30
D10_A_2: XS3.30
D10_A_3: XS5.30
D10_A_4: XS7.30
D10_A_5: XS9.30
D10_A_6: XS11.30
D10_A_7: XS13.30
D10_A_8: XS15.30
D10_A_9: XS17.30
D10_A_10: XS19.30
D10_A_11: XS21.30
D10_A_12: XS23.30
D10_B_1: XS1.24
D10_B_2: XS3.24
D10_B_3: XS5.24
D10_B_4: XS7.24
D10_B_5: XS9.24
D10_B_6: XS11.24
D10_B_7: XS13.24
D10_B_8: XS15.24
D10_B_9: XS17.24
D10_B_10: XS19.24
D10_B_11: XS21.24
D10_B_12: XS23.24
D10_C_1: XS2.34
D10_C_2: XS4.34
D10_C_3: XS6.34
D10_C_4: XS8.34
D10_C_5: XS10.34
D10_C_6: XS12.34
D10_C_7: XS14.34
D10_C_8: XS16.34
D10_C_9: XS18.34
D10_C_10: XS20.34
D10_C_11: XS22.34
D10_C_12: XS24.34
D10_D_1: XS2.15
D10_D_2: XS4.15
D10_D_3: XS6.15
D10_D_4: XS8.15
D10_D_5: XS10.15
D10_D_6: XS12.15
D10_D_7: XS14.15
D10_D_8: XS16.15
D10_D_9: XS18.15
D10_D_10: XS20.15
D10_D_11: XS22.15
D10_D_12: XS24.15
D11_A_1: XS1.5
D11_A_2: XS3.5
D11_A_3: XS5.5
D11_A_4: XS7.5
D11_A_5: XS9.5
D11_A_6: XS11.5
D11_A_7: XS13.5
D11_A_8: XS15.5
D11_A_9: XS17.5
D11_A_10: XS19.5
D11_A_11: XS21.5
D11_A_12: XS23.5
D11_B_1: XS1.36
D11_B_2: XS3.36
D11_B_3: XS5.36
D11_B_4: XS7.36
D11_B_5: XS9.36
D11_B_6: XS11.36
D11_B_7: XS13.36
D11_B_8: XS15.36
D11_B_9: XS17.36
D11_B_10: XS19.36
D11_B_11: XS21.36
D11_B_12: XS23.36
D11_C_1: XS2.9
D11_C_2: XS4.9
D11_C_3: XS6.9
D11_C_4: XS8.9
D11_C_5: XS10.9
D11_C_6: XS12.9
D11_C_7: XS14.9
D11_C_8: XS16.9
D11_C_9: XS18.9
D11_C_10: XS20.9
D11_C_11: XS22.9
D11_C_12: XS24.9
D11_D_1: XS2.28
D11_D_2: XS4.28
D11_D_3: XS6.28
D11_D_4: XS8.28
D11_D_5: XS10.28
D11_D_6: XS12.28
D11_D_7: XS14.28
D11_D_8: XS16.28
D11_D_9: XS18.28
D11_D_10: XS20.28
D11_D_11: XS22.28
D11_D_12: XS24.28
D12_A_1: XS1.29
D12_A_2: XS3.29
D12_A_3: XS5.29
D12_A_4: XS7.29
D12_A_5: XS9.29
D12_A_6: XS11.29
D12_A_7: XS13.29
D12_A_8: XS15.29
D12_A_9: XS17.29
D12_A_10: XS19.29
D12_A_11: XS21.29
D12_A_12: XS23.29
D12_B_1: XS1.23
D12_B_2: XS3.23
D12_B_3: XS5.23
D12_B_4: XS7.23
D12_B_5: XS9.23
D12_B_6: XS11.23
D12_B_7: XS13.23
D12_B_8: XS15.23
D12_B_9: XS17.23
D12_B_10: XS19.23
D12_B_11: XS21.23
D12_B_12: XS23.23
D12_C_1: XS2.35
D12_C_2: XS4.35
D12_C_3: XS6.35
D12_C_4: XS8.35
D12_C_5: XS10.35
D12_C_6: XS12.35
D12_C_7: XS14.35
D12_C_8: XS16.35
D12_C_9: XS18.35
D12_C_10: XS20.35
D12_C_11: XS22.35
D12_C_12: XS24.35
D12_D_1: XS2.16
D12_D_2: XS4.16
D12_D_3: XS6.16
D12_D_4: XS8.16
D12_D_5: XS10.16
D12_D_6: XS12.16
D12_D_7: XS14.16
D12_D_8: XS16.16
D12_D_9: XS18.16
D12_D_10: XS20.16
D12_D_11: XS22.16
D12_D_12: XS24.16
D13_A_1: XS1.6
D13_A_2: XS3.6
D13_A_3: XS5.6
D13_A_4: XS7.6
D13_A_5: XS9.6
D13_A_6: XS11.6
D13_A_7: XS13.6
D13_A_8: XS15.6
D13_A_9: XS17.6
D13_A_10: XS19.6
D13_A_11: XS21.6
D13_A_12: XS23.6
D13_B_1: XS1.37
D13_B_2: XS3.37
D13_B_3: XS5.37
D13_B_4: XS7.37
D13_B_5: XS9.37
D13_B_6: XS11.37
D13_B_7: XS13.37
D13_B_8: XS15.37
D13_B_9: XS17.37
D13_B_10: XS19.37
D13_B_11: XS21.37
D13_B_12: XS23.37
D13_C_1: XS2.8
D13_C_2: XS4.8
D13_C_3: XS6.8
D13_C_4: XS8.8
D13_C_5: XS10.8
D13_C_6: XS12.8
D13_C_7: XS14.8
D13_C_8: XS16.8
D13_C_9: XS18.8
D13_C_10: XS20.8
D13_C_11: XS22.8
D13_C_12: XS24.8
D13_D_1: XS2.27
D13_D_2: XS4.27
D13_D_3: XS6.27
D13_D_4: XS8.27
D13_D_5: XS10.27
D13_D_6: XS12.27
D13_D_7: XS14.27
D13_D_8: XS16.27
D13_D_9: XS18.27
D13_D_10: XS20.27
D13_D_11: XS22.27
D13_D_12: XS24.27
D14_A_1: XS1.44
D14_A_2: XS3.44
D14_A_3: XS5.44
D14_A_4: XS7.44
D14_A_5: XS9.44
D14_A_6: XS11.44
D14_A_7: XS13.44
D14_A_8: XS15.44
D14_A_9: XS17.44
D14_A_10: XS19.44
D14_A_11: XS21.44
D14_A_12: XS23.44
D14_B_1: XS1.13
D14_B_2: XS3.13
D14_B_3: XS5.13
D14_B_4: XS7.13
D14_B_5: XS9.13
D14_B_6: XS11.13
D14_B_7: XS13.13
D14_B_8: XS15.13
D14_B_9: XS17.13
D14_B_10: XS19.13
D14_B_11: XS21.13
D14_B_12: XS23.13
D14_C_1: XS2.45
D14_C_2: XS4.45
D14_C_3: XS6.45
D14_C_4: XS8.45
D14_C_5: XS10.45
D14_C_6: XS12.45
D14_C_7: XS14.45
D14_C_8: XS16.45
D14_C_9: XS18.45
D14_C_10: XS20.45
D14_C_11: XS22.45
D14_C_12: XS24.45
D14_D_1: XS2.1
D14_D_2: XS4.1
D14_D_3: XS6.1
D14_D_4: XS8.1
D14_D_5: XS10.1
D14_D_6: XS12.1
D14_D_7: XS14.1
D14_D_8: XS16.1
D14_D_9: XS18.1
D14_D_10: XS20.1
D14_D_11: XS22.1
D14_D_12: XS24.1
D15_A_1: XS1.43
D15_A_2: XS3.43
D15_A_3: XS5.43
D15_A_4: XS7.43
D15_A_5: XS9.43
D15_A_6: XS11.43
D15_A_7: XS13.43
D15_A_8: XS15.43
D15_A_9: XS17.43
D15_A_10: XS19.43
D15_A_11: XS21.43
D15_A_12: XS23.43
D15_B_1: XS1.12
D15_B_2: XS3.12
D15_B_3: XS5.12
D15_B_4: XS7.12
D15_B_5: XS9.12
D15_B_6: XS11.12
D15_B_7: XS13.12
D15_B_8: XS15.12
D15_B_9: XS17.12
D15_B_10: XS19.12
D15_B_11: XS21.12
D15_B_12: XS23.12
D15_C_1: XS2.46
D15_C_2: XS4.46
D15_C_3: XS6.46
D15_C_4: XS8.46
D15_C_5: XS10.46
D15_C_6: XS12.46
D15_C_7: XS14.46
D15_C_8: XS16.46
D15_C_9: XS18.46
D15_C_10: XS20.46
D15_C_11: XS22.46
D15_C_12: XS24.46
D15_D_1: XS2.2
D15_D_2: XS4.2
D15_D_3: XS6.2
D15_D_4: XS8.2
D15_D_5: XS10.2
D15_D_6: XS12.2
D15_D_7: XS14.2
D15_D_8: XS16.2
D15_D_9: XS18.2
D15_D_10: XS20.2
D15_D_11: XS22.2
D15_D_12: XS24.2
D16_A_1: XS1.19
D16_A_2: XS3.19
D16_A_3: XS5.19
D16_A_4: XS7.19
D16_A_5: XS9.19
D16_A_6: XS11.19
D16_A_7: XS13.19
D16_A_8: XS15.19
D16_A_9: XS17.19
D16_A_10: XS19.19
D16_A_11: XS21.19
D16_A_12: XS23.19
D16_B_1: XS1.50
D16_B_2: XS3.50
D16_B_3: XS5.50
D16_B_4: XS7.50
D16_B_5: XS9.50
D16_B_6: XS11.50
D16_B_7: XS13.50
D16_B_8: XS15.50
D16_B_9: XS17.50
D16_B_10: XS19.50
D16_B_11: XS21.50
D16_B_12: XS23.50
D16_C_1: XS2.20
D16_C_2: XS4.20
D16_C_3: XS6.20
D16_C_4: XS8.20
D16_C_5: XS10.20
D16_C_6: XS12.20
D16_C_7: XS14.20
D16_C_8: XS16.20
D16_C_9: XS18.20
D16_C_10: XS20.20
D16_C_11: XS22.20
D16_C_12: XS24.20
D16_D_1: XS2.39
D16_D_2: XS4.39
D16_D_3: XS6.39
D16_D_4: XS8.39
D16_D_5: XS10.39
D16_D_6: XS12.39
D16_D_7: XS14.39
D16_D_8: XS16.39
D16_D_9: XS18.39
D16_D_10: XS20.39
D16_D_11: XS22.39
D16_D_12: XS24.39
LD_A_1: XS1.28
LD_A_2: XS3.28
LD_A_3: XS5.28
LD_A_4: XS7.28
LD_A_5: XS9.28
LD_A_6: XS11.28
LD_A_7: XS13.28
LD_A_8: XS15.28
LD_A_9: XS17.28
LD_A_10: XS19.28
LD_A_11: XS21.28
LD_A_12: XS23.28
LD_B_1: XS1.22
LD_B_2: XS3.22
LD_B_3: XS5.22
LD_B_4: XS7.22
LD_B_5: XS9.22
LD_B_6: XS11.22
LD_B_7: XS13.22
LD_B_8: XS15.22
LD_B_9: XS17.22
LD_B_10: XS19.22
LD_B_11: XS21.22
LD_B_12: XS23.22
LD_C_1: XS2.36
LD_C_2: XS4.36
LD_C_3: XS6.36
LD_C_4: XS8.36
LD_C_5: XS10.36
LD_C_6: XS12.36
LD_C_7: XS14.36
LD_C_8: XS16.36
LD_C_9: XS18.36
LD_C_10: XS20.36
LD_C_11: XS22.36
LD_C_12: XS24.36
LD_D_1: XS2.17
LD_D_2: XS4.17
LD_D_3: XS6.17
LD_D_4: XS8.17
LD_D_5: XS10.17
LD_D_6: XS12.17
LD_D_7: XS14.17
LD_D_8: XS16.17
LD_D_9: XS18.17
LD_D_10: XS20.17
LD_D_11: XS22.17
LD_D_12: XS24.17
SUBA1_DLY_5V0: XS2.50
SUBA1_DLY_5V1: XS2.33
SUBA1_DLY_5V2: XS2.6
SUBA2_DLY_5V0: XS4.50
SUBA2_DLY_5V1: XS4.33
SUBA2_DLY_5V2: XS4.6
SUBA3_DLY_5V0: XS6.50
SUBA3_DLY_5V1: XS6.33
SUBA3_DLY_5V2: XS6.6
SUBA4_DLY_5V0: XS8.50
SUBA4_DLY_5V1: XS8.33
SUBA4_DLY_5V2: XS8.6
SUBA5_DLY_5V0: XS10.50
SUBA5_DLY_5V1: XS10.33
SUBA5_DLY_5V2: XS10.6
SUBA6_DLY_5V0: XS12.50
SUBA6_DLY_5V1: XS12.33
SUBA6_DLY_5V2: XS12.6
SUBA7_DLY_5V0: XS14.50
SUBA7_DLY_5V1: XS14.33
SUBA7_DLY_5V2: XS14.6
SUBA8_DLY_5V0: XS16.50
SUBA8_DLY_5V1: XS16.33
SUBA8_DLY_5V2: XS16.6
SUBA9_DLY_5V0: XS18.50
SUBA9_DLY_5V1: XS18.33
SUBA9_DLY_5V2: XS18.6
SUBA10_DLY_5V0: XS20.50
SUBA10_DLY_5V1: XS20.33
SUBA10_DLY_5V2: XS20.6
SUBA11_DLY_5V0: XS22.50
SUBA11_DLY_5V1: XS22.33
SUBA11_DLY_5V2: XS22.6
SUBA12_DLY_5V0: XS24.50
SUBA12_DLY_5V1: XS24.33
SUBA12_DLY_5V2: XS24.6

### Library data of the parts
XS1 XS3 XS5 XS7 XS9 XS11 XS13 XS15 XS17 XS19 XS21 XS23 = 50PIN_MY_R_AB
XS2 XS4 XS6 XS8 XS10 XS12 XS14 XS16 XS18 XS20 XS22 XS24 = 50PIN_MY_R_CD

## Sheet MY_beamControl_R_对外接口.SchDoc
size A4
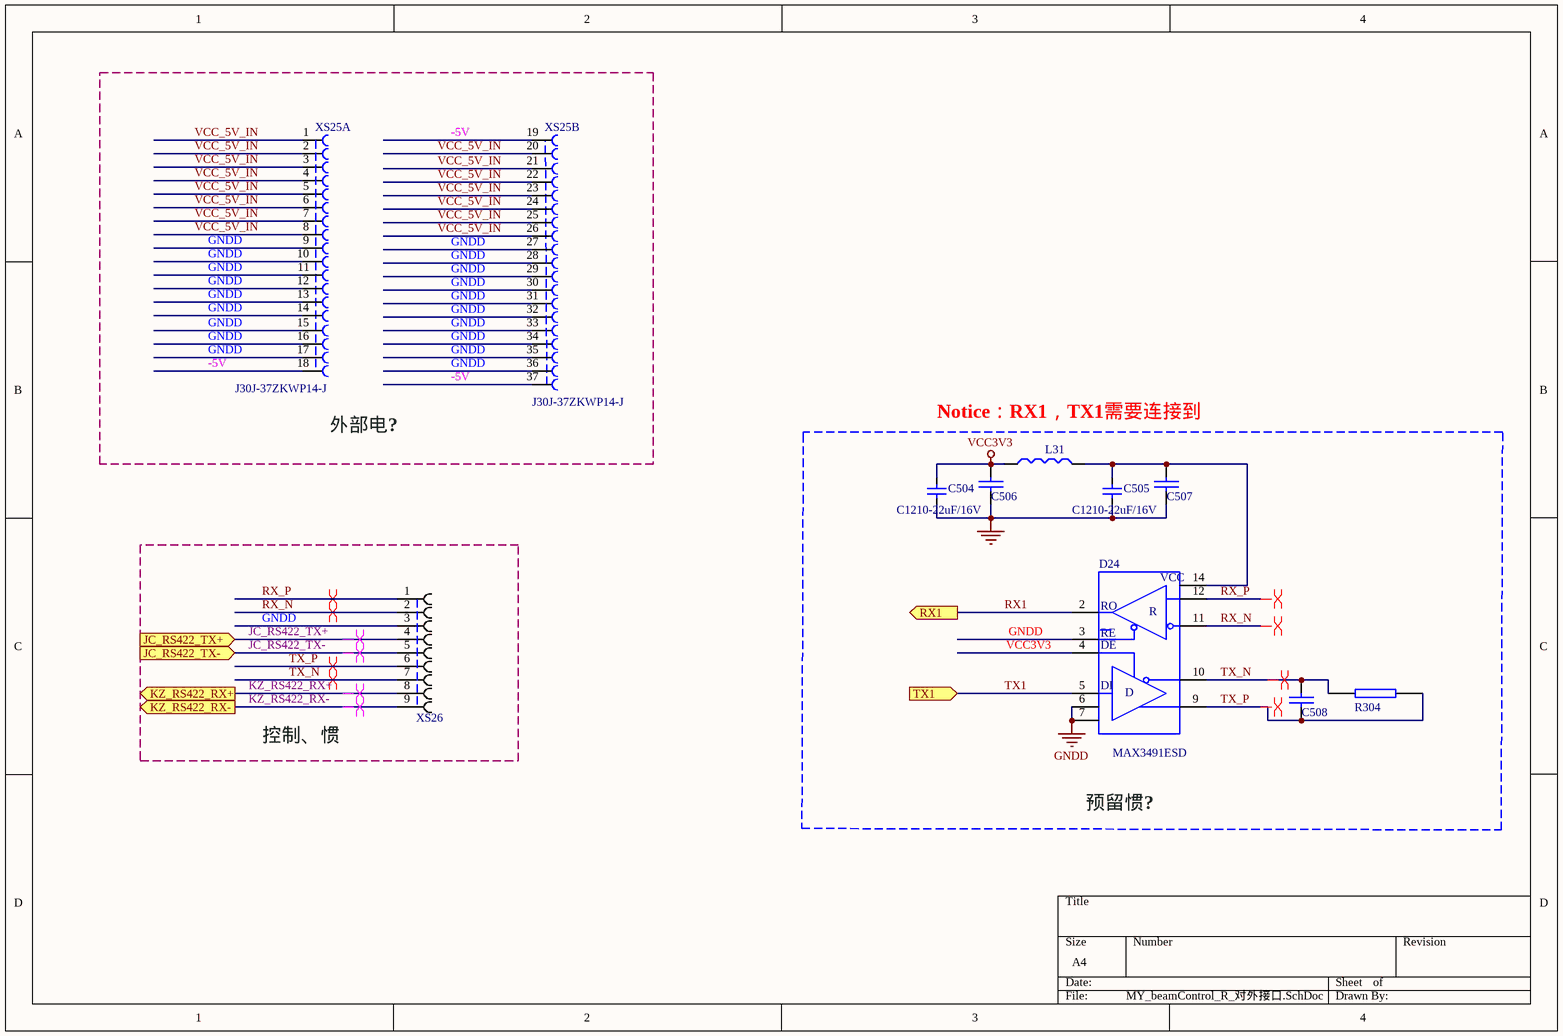
[diagram p40: MY_beamControl_R_对外接口.SchDoc]

### Parts
C504  C1210-22uF/16V  [C1210]
C505  C1210-22uF/16V  [C1210]
C506  C0402-0.1uF/16V  [c0402]  (value not drawn)
C507  C0402-0.1uF/16V  [c0402]  (value not drawn)
C508  C0402-0.1uF/16V  [c0402]  (value not drawn)
D24  MAX3491ESD  [SO-14]
L31  MPZ2012S101A  [R0805]  (value not drawn)
R304  0603-121(120Ω)  [R0603]  (value not drawn)
XS25  J30J-37ZKWP14-J  [J30J-37ZKWP14]  (parts A,B of 2)
XS26  J30J-9ZKWP7-J(成套订购)  [J30J-9ZKWP7-J]  (value not drawn)

### Blocks framed on the sheet
外部电?: XS25
控制、惯: XS26

### Ports
JC_RS422_TX+ (in), JC_RS422_TX- (in), KZ_RS422_RX+ (out), KZ_RS422_RX- (out), RX1 (out), TX1 (in)

### Nets
GNDD: C504.2 C505.2 C506.2 C507.2 D24.3 D24.6 D24.7(GND) XS25.9 XS25.10 XS25.11 XS25.12 XS25.13 XS25.14 XS25.15 XS25.16 XS25.17 XS25.27 XS25.28 XS25.29 XS25.30 XS25.31 XS25.32 XS25.33 XS25.34 XS25.35 XS25.36 XS26.3
VCC3V3: C504.1 C506.1 D24.4 L31.1
-5V: XS25.18 XS25.19 XS25.37
JC_RS422_TX+: XS26.4 ; port JC_RS422_TX+
JC_RS422_TX-: XS26.5 ; port JC_RS422_TX-
KZ_RS422_RX+: XS26.8 ; port KZ_RS422_RX+
KZ_RS422_RX-: XS26.9 ; port KZ_RS422_RX-
RX1: D24.2 ; port RX1
RX_N: D24.11 XS26.2
RX_P: D24.12 XS26.1
TX1: D24.5 ; port TX1
TX_N: C508.1 D24.10 R304.2 XS26.7
TX_P: C508.2 D24.9 R304.1 XS26.6
VCC_5V_IN: XS25.1 XS25.2 XS25.3 XS25.4 XS25.5 XS25.6 XS25.7 XS25.8 XS25.20 XS25.21 XS25.22 XS25.23 XS25.24 XS25.25 XS25.26
NetC505_1: C505.1 C507.1 D24.14(VCC) L31.2

### Layout directives
differential pair: JC_RS422_TX+, JC_RS422_TX-, KZ_RS422_RX+, KZ_RS422_RX-, RX_N, RX_P, TX_N, TX_P

### Notes on the sheet
- Notice：RX1，TX1需要连接到
- 预留惯?
- (in symbol MAX1482) RO; R; RE; DE; DI; D

### Library data of the parts
C506-C508 = C_2
D24 = MAX1482: Part Field 1: 6
L31 = ProE2A0.TMP_UnNamed_1
R304 = RES2
XS25 = 37PIN
XS26 = D: 9芯D型连接器
C504 C505 = C1210-22uF/16V: Part_number: C1210-22uF/16V; Part_type: CAP; Value: C1210-22uF/16V; Schematic_Part: CAP; PCB_Footprint: C1210